# EAGLE design test_o2 (EAGLE 6.1)

## Sheet 1 of 2
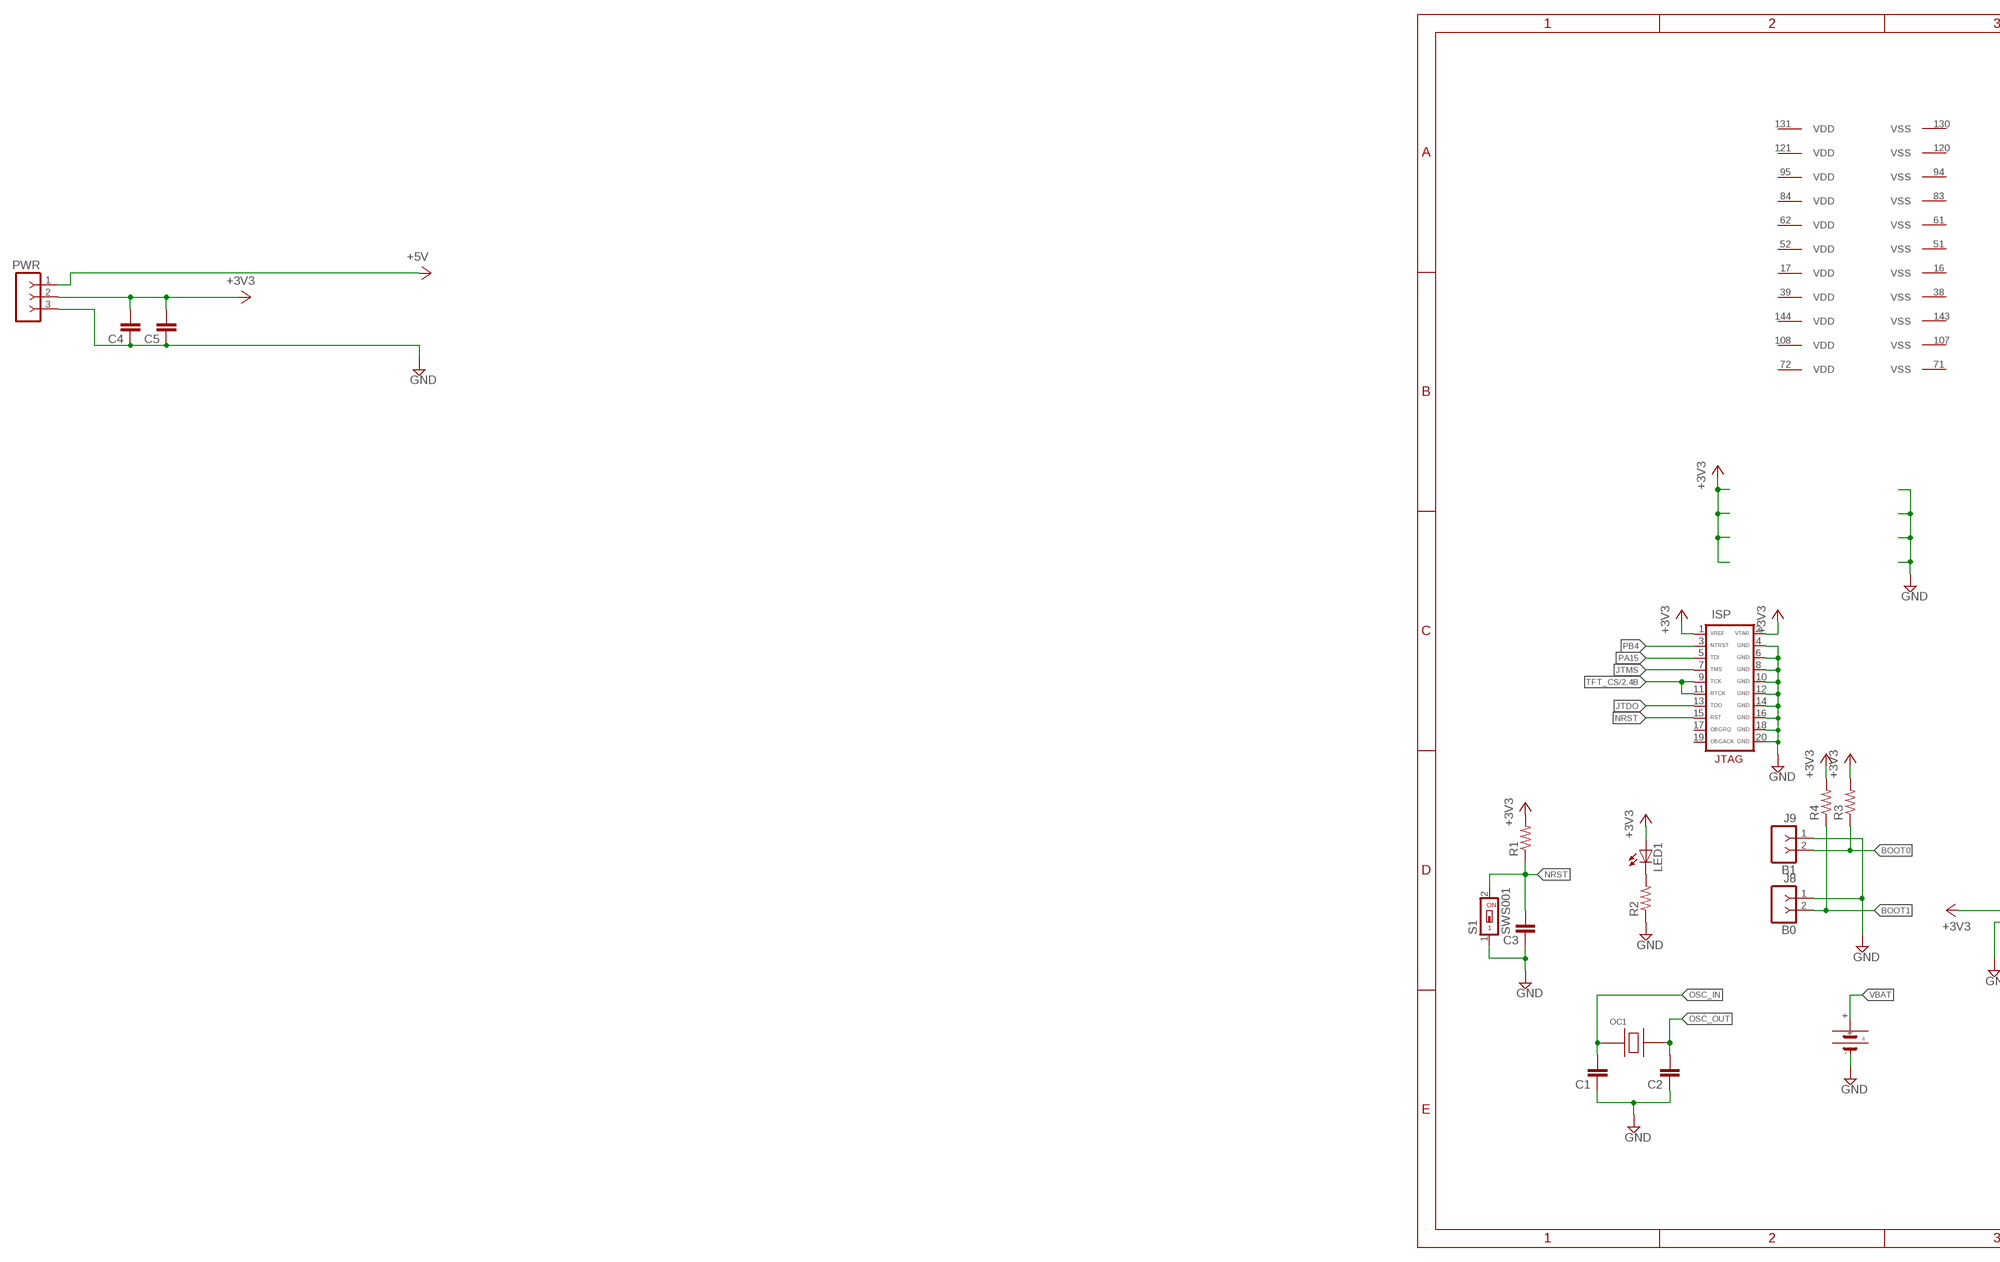
[diagram p0: schematic, sheet 1, part 1 of 2]
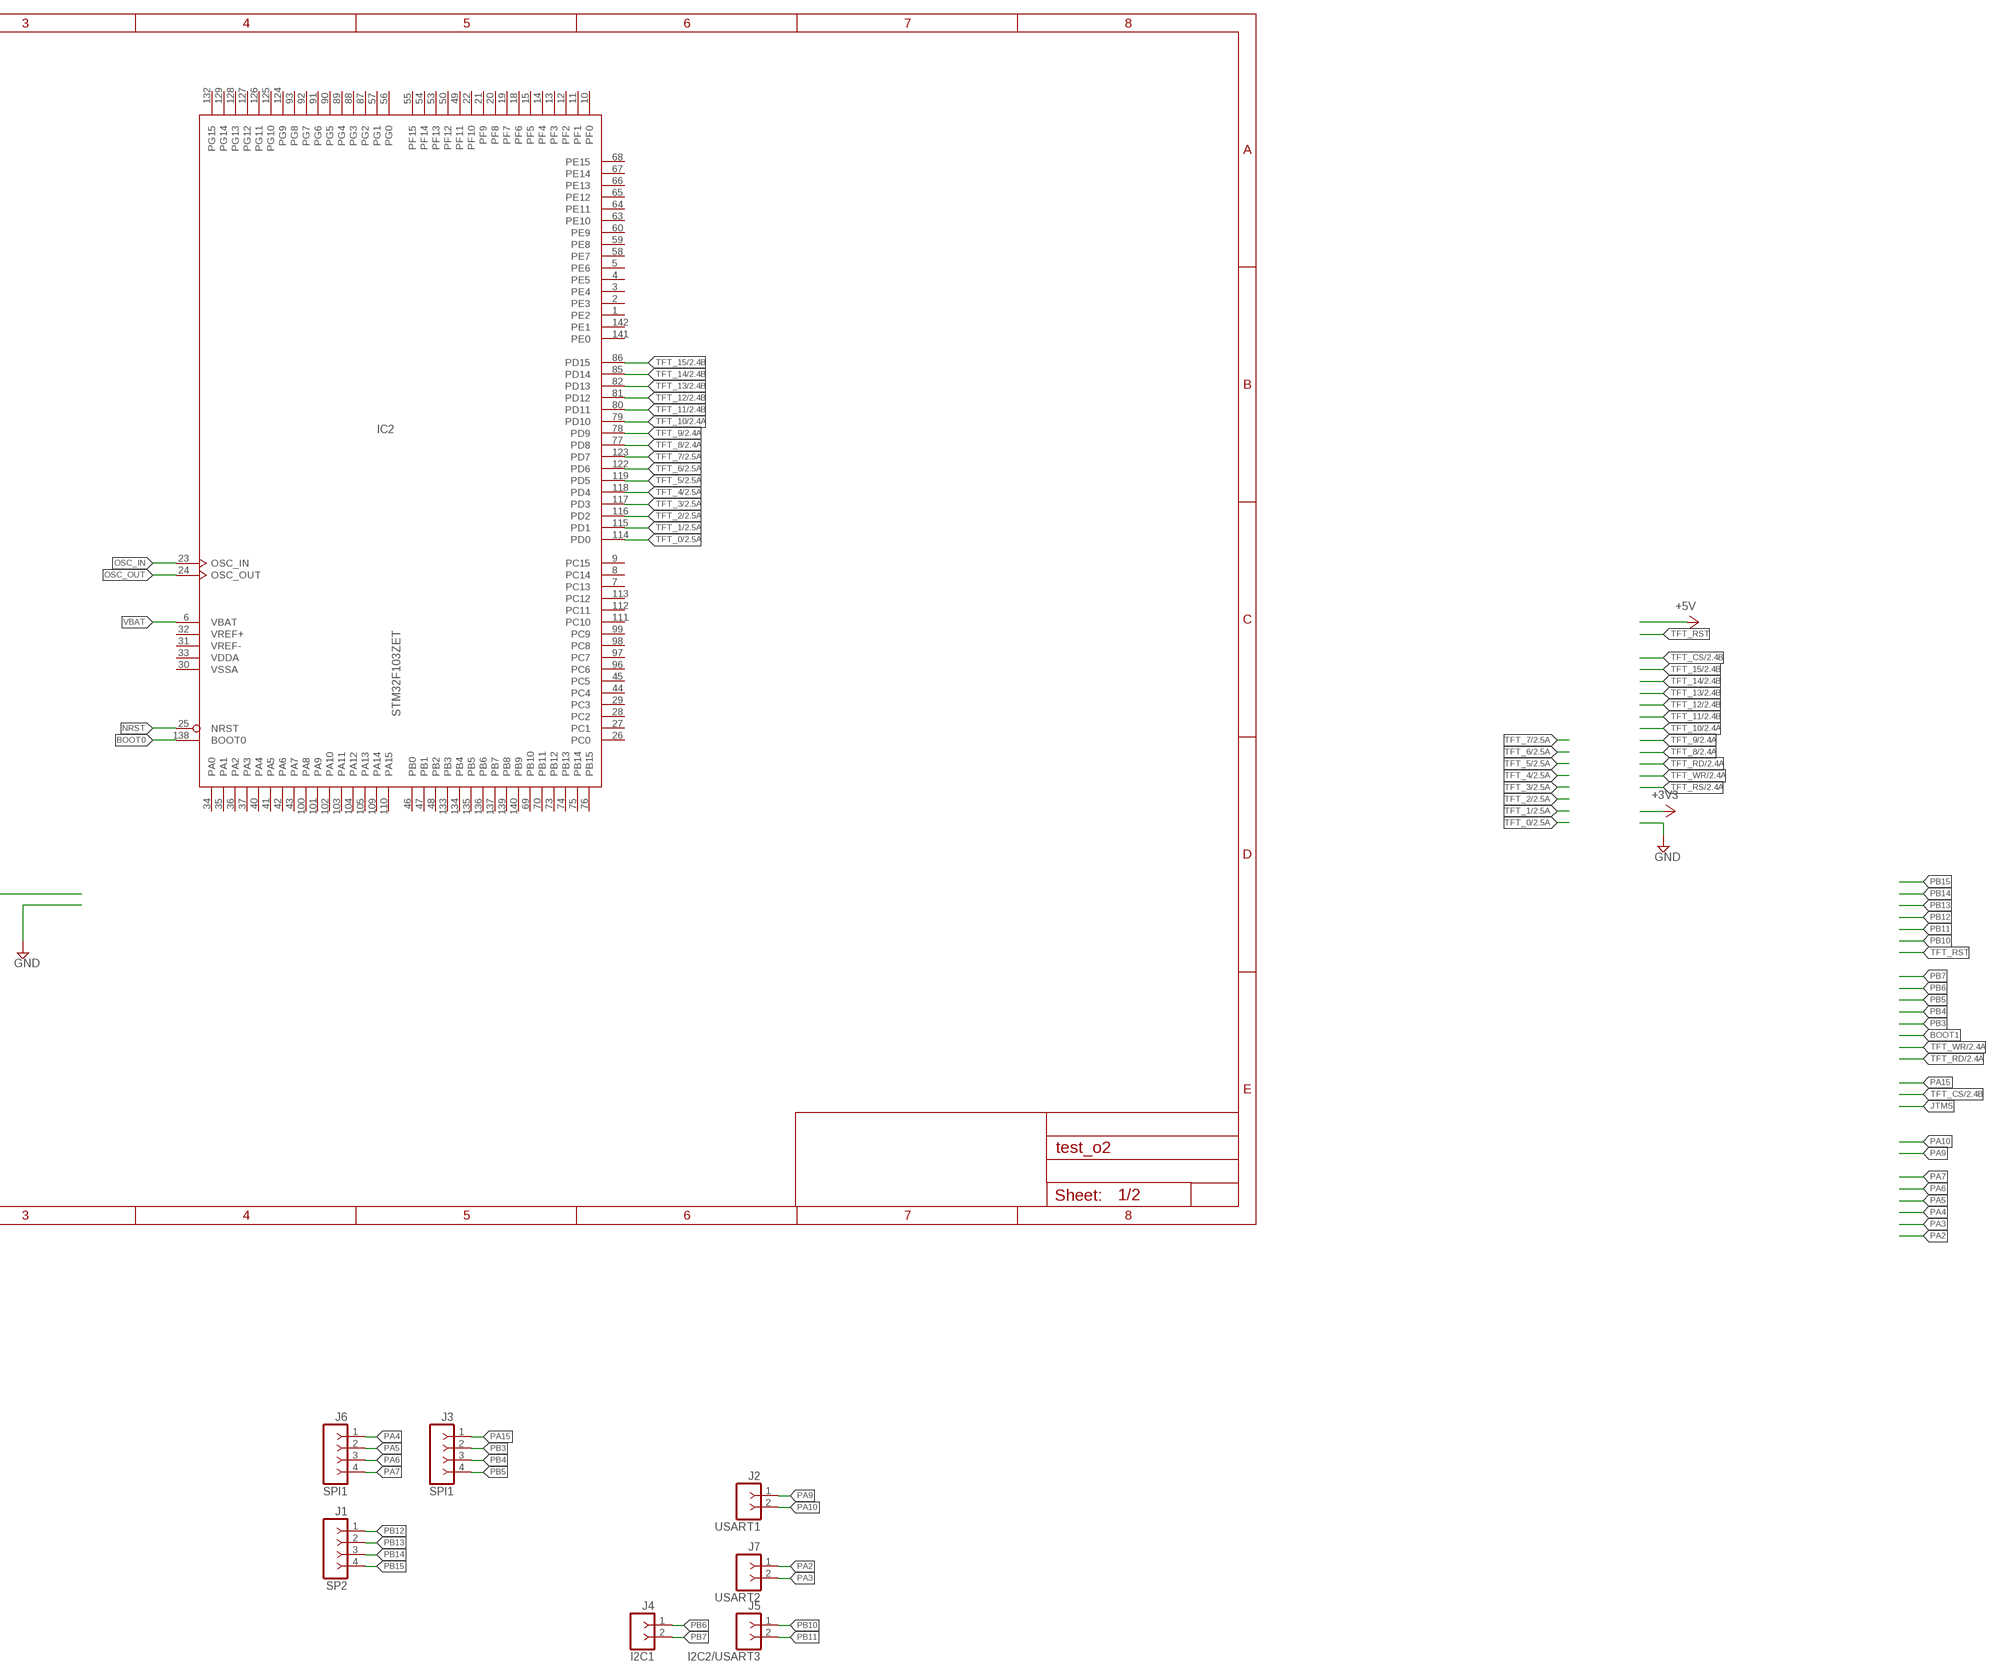
[diagram p1: schematic, sheet 1, part 2 of 2]

### Parts
C1  C-EUC1206  [C1206]
C2  C-EUC1206  [C1206]
C3  C-EUC1206  [C1206]
C4  C-EUC1206  [C1206]
C5  C-EUC1206  [C1206]
IC2  STM32F103ZET  [LQFP144]
ISP  JTAG  JTAG-ARM-PAK100/2500-20  [PAK100/2500-20]
J1  SP2  F-1X04-SIP-100-40  [SIP-100-04-40]
J2  USART1  F-1X02-SIP-100-40  [SIP-100-02-40]
J3  SPI1  F-1X04-SIP-100-40  [SIP-100-04-40]
J4  I2C1  F-1X02-SIP-100-40  [SIP-100-02-40]
J5  I2C2/USART3  F-1X02-SIP-100-40  [SIP-100-02-40]
J6  SPI1  F-1X04-SIP-100-40  [SIP-100-04-40]
J7  USART2  F-1X02-SIP-100-40  [SIP-100-02-40]
J8  B0  F-1X02-SIP-100-40  [SIP-100-02-40]
J9  B1  F-1X02-SIP-100-40  [SIP-100-02-40]
LED1  LEDSML1206  [SML1206]
OC1  SMAQ-7050B  [IQG7050B]
PWR  F-1X03-SIP-100-40  [SIP-100-03-40]
R1  R-US_R1206  [R1206]
R2  R-US_R1206  [R1206]
R3  R-US_R1206  [R1206]
R4  R-US_R1206  [R1206]
S1  SWS001  [SMS-001]
U$2  1220BATTERY_SF  [1220BATTERY]

### Nets
+3V3: C4.2 C5.2 ISP.1(VREF) ISP.2(VTAR) LED1.A PWR.2 R1.2 R3.2 R4.2 ; also sheet 2
+5V: PWR.1 ; also sheet 2
BOOT0: IC2.138(BOOT0) J9.2 R3.1
BOOT1: J8.2 R4.1
GND: C1.1 C2.1 C3.1 C4.1 C5.1 ISP.4(GND) ISP.6(GND) ISP.8(GND) ISP.10(GND) ISP.12(GND) ISP.14(GND) ISP.16(GND) ISP.18(GND) ISP.20(GND) J8.1 J9.1 PWR.3 R2.1 S1.1 U$2.- ; also sheet 2
JTDO: ISP.13(TDO)
JTMS: ISP.7(TMS)
N$1: LED1.C R2.2
NRST: C3.2 IC2.25(NRST) ISP.15(RST) R1.1 S1.2
OSC_IN: C1.2 IC2.23(OSC_IN) OC1.P$1(PIN1)
OSC_OUT: C2.2 IC2.24(OSC_OUT) OC1.P$3(PIN2)
PA2: J7.1
PA3: J7.2
PA4: J6.1
PA5: J6.2
PA6: J6.3
PA7: J6.4
PA9: J2.1
PA10: J2.2
PA15: ISP.5(TDI) J3.1
PB3: J3.2
PB4: ISP.3(NTRST) J3.3
PB5: J3.4
PB6: J4.1
PB7: J4.2
PB10: J5.1
PB11: J5.2
PB12: J1.1
PB13: J1.2
PB14: J1.3
PB15: J1.4
TFT_0: IC2.114(PD0) ; also sheet 2
TFT_1: IC2.115(PD1) ; also sheet 2
TFT_2: IC2.116(PD2) ; also sheet 2
TFT_3: IC2.117(PD3) ; also sheet 2
TFT_4: IC2.118(PD4) ; also sheet 2
TFT_5: IC2.119(PD5) ; also sheet 2
TFT_6: IC2.122(PD6) ; also sheet 2
TFT_7: IC2.123(PD7) ; also sheet 2
TFT_8: IC2.77(PD8) ; also sheet 2
TFT_9: IC2.78(PD9) ; also sheet 2
TFT_10: IC2.79(PD10) ; also sheet 2
TFT_11: IC2.80(PD11) ; also sheet 2
TFT_12: IC2.81(PD12) ; also sheet 2
TFT_13: IC2.82(PD13) ; also sheet 2
TFT_14: IC2.85(PD14) ; also sheet 2
TFT_15: IC2.86(PD15) ; also sheet 2
TFT_CS: ISP.9(TCK) ISP.11(RTCK) ; also sheet 2
VBAT: IC2.6(VBAT) U$2.+
Unconnected: IC2.1(PE2) IC2.2(PE3) IC2.3(PE4) IC2.4(PE5) IC2.5(PE6) IC2.7(PC13) IC2.8(PC14) IC2.9(PC15) IC2.10(PF0) IC2.11(PF1) IC2.12(PF2) IC2.13(PF3) IC2.14(PF4) IC2.15(PF5) IC2.18(PF6) IC2.19(PF7) IC2.20(PF8) IC2.21(PF9) IC2.22(PF10) IC2.26(PC0) IC2.27(PC1) IC2.28(PC2) IC2.29(PC3) IC2.34(PA0) IC2.35(PA1) IC2.36(PA2) IC2.37(PA3) IC2.40(PA4) IC2.41(PA5) IC2.42(PA6) IC2.43(PA7) IC2.44(PC4) IC2.45(PC5) IC2.46(PB0) IC2.47(PB1) IC2.48(PB2) IC2.49(PF11) IC2.50(PF12) IC2.53(PF13) IC2.54(PF14) IC2.55(PF15) IC2.56(PG0) IC2.57(PG1) IC2.58(PE7) IC2.59(PE8) IC2.60(PE9) IC2.63(PE10) IC2.64(PE11) IC2.65(PE12) IC2.66(PE13) IC2.67(PE14) IC2.68(PE15) IC2.69(PB10) IC2.70(PB11) IC2.73(PB12) IC2.74(PB13) IC2.75(PB14) IC2.76(PB15) IC2.87(PG2) IC2.88(PG3) IC2.89(PG4) IC2.90(PG5) IC2.91(PG6) IC2.92(PG7) IC2.93(PG8) IC2.96(PC6) IC2.97(PC7) IC2.98(PC8) IC2.99(PC9) IC2.100(PA8) IC2.101(PA9) IC2.102(PA10) IC2.103(PA11) IC2.104(PA12) IC2.105(PA13) IC2.109(PA14) IC2.110(PA15) IC2.111(PC10) IC2.112(PC11) IC2.113(PC12) IC2.124(PG9) IC2.125(PG10) IC2.126(PG11) IC2.127(PG12) IC2.128(PG13) IC2.129(PG14) IC2.132(PG15) IC2.133(PB3) IC2.134(PB4) IC2.135(PB5) IC2.136(PB6) IC2.137(PB7) IC2.139(PB8) IC2.140(PB9) IC2.141(PE0) IC2.142(PE1) ISP.17(OBGRQ) ISP.19(OBGACK)

## Sheet 2 of 2
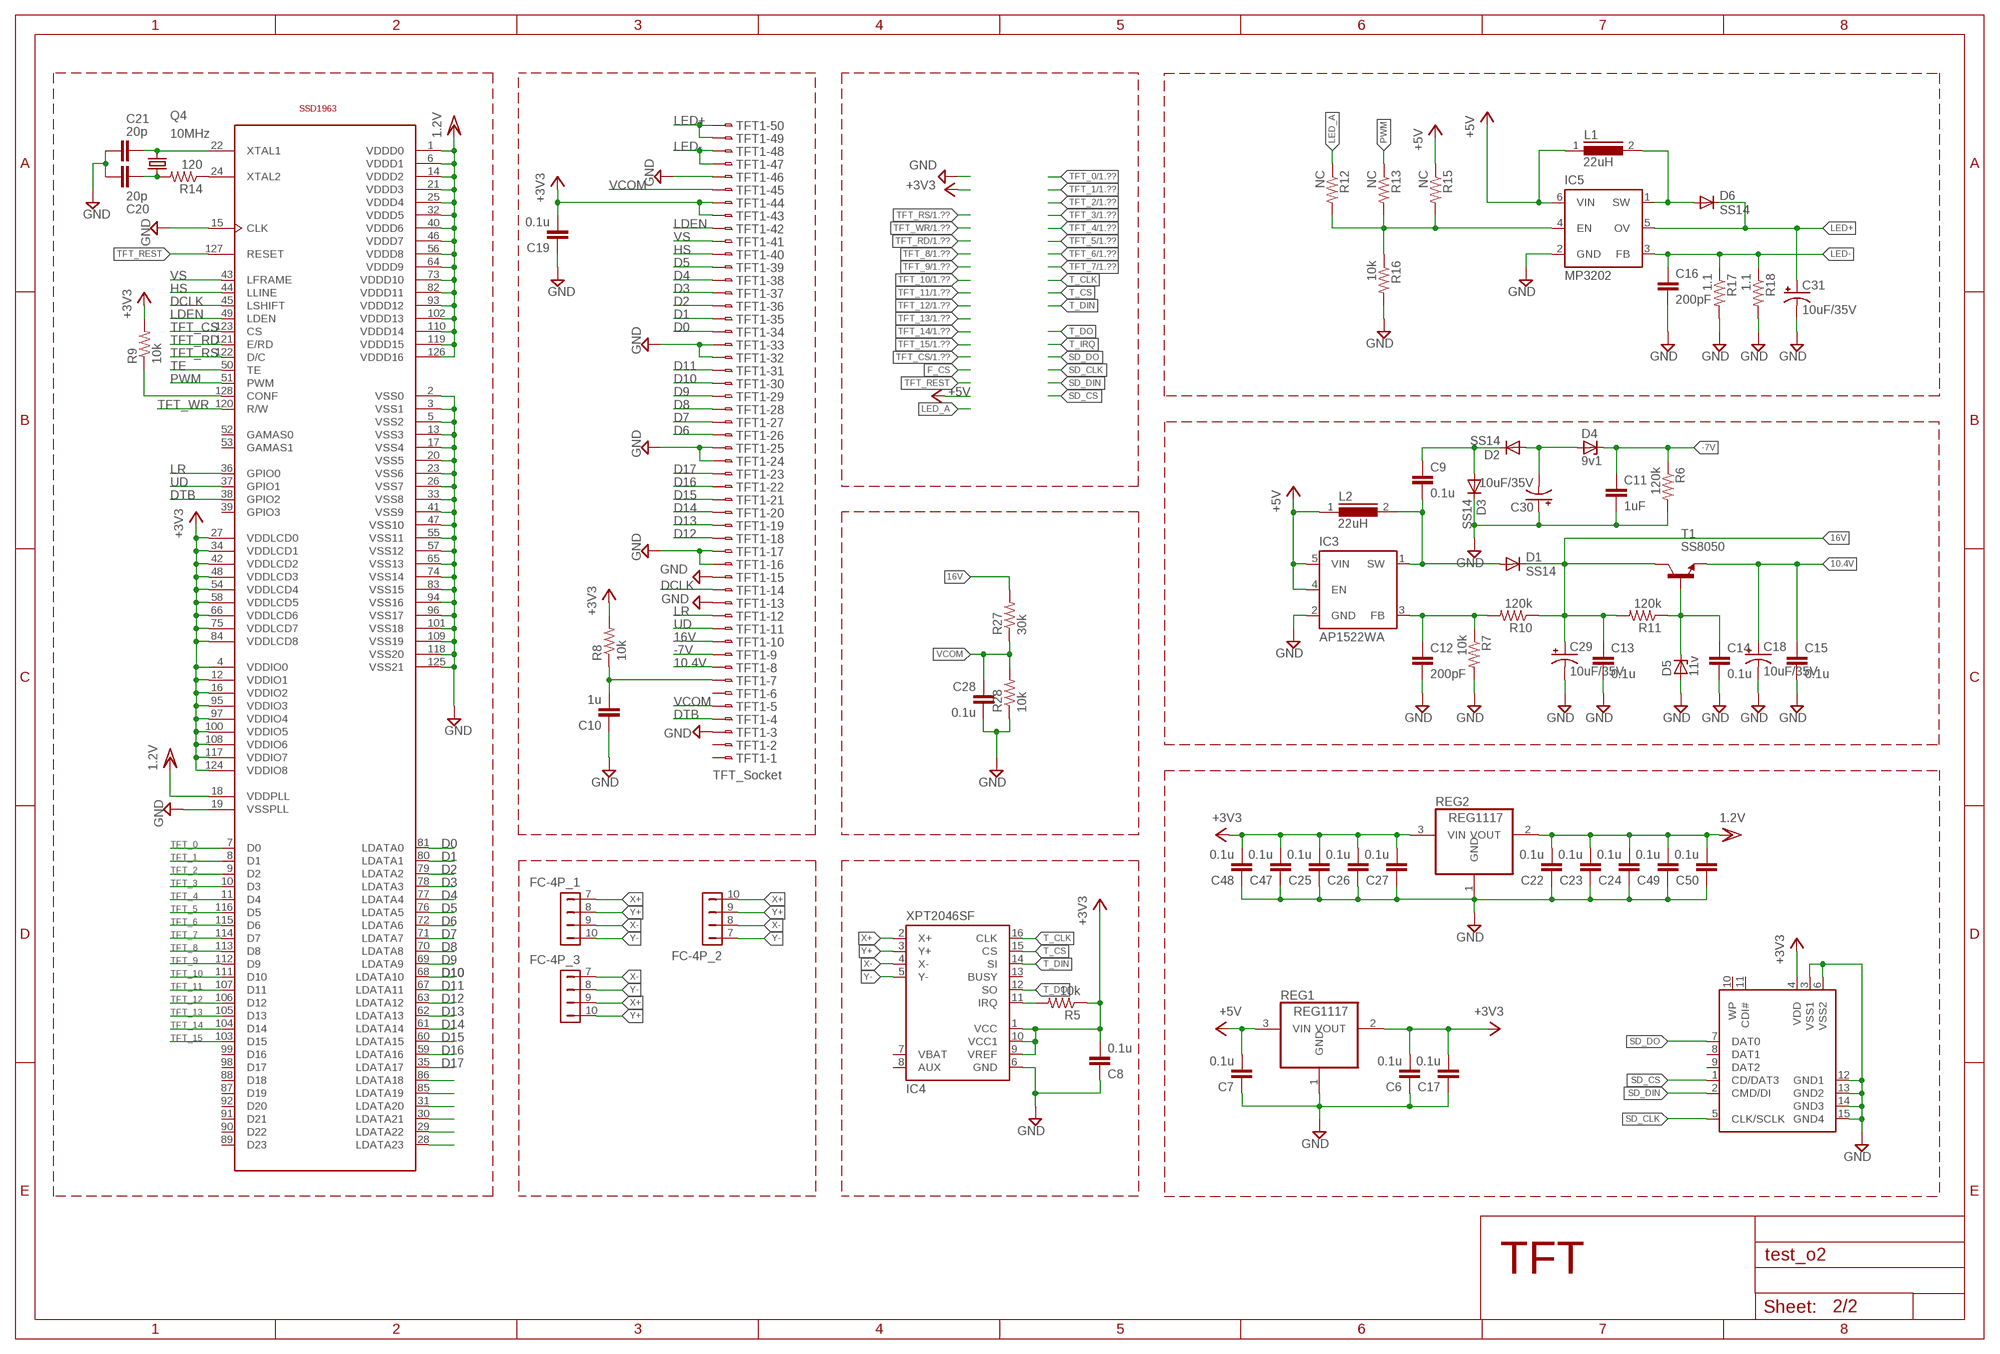
[diagram p2: schematic, sheet 2]

### Parts
C6  0.1u  C-EUC0805  [C0805]
C7  0.1u  C-EUC0805  [C0805]
C8  0.1u  C-EUC0805  [C0805]
C9  0.1u  C-EUC0805  [C0805]
C10  1u  C-EUC0805  [C0805]
C11  1uF  C-EUC0805  [C0805]
C12  200pF  C-EUC0805  [C0805]
C13  0.1u  C-EUC0805  [C0805]
C14  0.1u  C-EUC0805  [C0805]
C15  0.1u  C-EUC0805  [C0805]
C16  200pF  C-EUC0805  [C0805]
C17  0.1u  C-EUC0805  [C0805]
C18  10uF/35V  CPOL-USB/3528-21R  [B/3528-21R]
C19  0.1u  C-EUC0805  [C0805]
C20  20p  C-EUC0805  [C0805]
C21  20p  C-EUC0805  [C0805]
C22  0.1u  C-EUC0805  [C0805]
C23  0.1u  C-EUC0805  [C0805]
C24  0.1u  C-EUC0805  [C0805]
C25  0.1u  C-EUC0805  [C0805]
C26  0.1u  C-EUC0805  [C0805]
C27  0.1u  C-EUC0805  [C0805]
C28  0.1u  C-EUC0805  [C0805]
C29  10uF/35V  CPOL-USB/3528-21R  [B/3528-21R]
C30  10uF/35V  CPOL-USB/3528-21R  [B/3528-21R]
C31  10uF/35V  CPOL-USB/3528-21R  [B/3528-21R]
C47  0.1u  C-EUC0805  [C0805]
C48  0.1u  C-EUC0805  [C0805]
C49  0.1u  C-EUC0805  [C0805]
C50  0.1u  C-EUC0805  [C0805]
D1  SS14  DIODE-DO214AC  [DO214AC]
D2  SS14  DIODE-DO214AC  [DO214AC]
D3  SS14  DIODE-DO214AC  [DO214AC]
D4  9v1  ZENER-DIODESOD80C  [SOD80C]
D5  11v  ZENER-DIODESOD80C  [SOD80C]
D6  SS14  DIODE-DO214AC  [DO214AC]
FC-4P_1  FH12-04S-1S  [FH12-4S-1SH]
FC-4P_2  FH12-04S-1S  [FH12-4S-1SH]
FC-4P_3  FH12-04S-1S  [FH12-4S-1SH]
IC1  SSD1963LQFP  [LQFP128]
IC3  AP1522WA  [SOT23-5L]
IC4  XPT2046SF  [TSSOP16L]
IC5  MP3202  [SOT23-6L]
L1  22uH  DR74  [DR74]
L2  22uH  DR74  [DR74]
Q4  10MHz  CRYSTALHC49UP  [HC49UP]
R5  10k  R-US_R0805  [R0805]
R6  120k  R-US_R0805  [R0805]
R7  10k  R-US_R0805  [R0805]
R8  10k  R-US_M0805  [M0805]
R9  10k  R-US_M0805  [M0805]
R10  120k  R-US_R0805  [R0805]
R11  120k  R-US_R0805  [R0805]
R12  NC  R-US_R0805  [R0805]
R13  NC  R-US_R0805  [R0805]
R14  120  R-US_M0805  [M0805]
R15  NC  R-US_R0805  [R0805]
R16  10k  R-US_R0805  [R0805]
R17  1.1  R-US_R0805  [R0805]
R18  1.1  R-US_R0805  [R0805]
R27  30k  R-US_M0805  [M0805]
R28  10k  R-US_M0805  [M0805]
REG1  REG1117  [SOT223]
REG2  REG1117  [SOT223]
SOC_1  MMC/SD  SDCARDVAR2  [SDCMF-10915W010]
T1  SS8050  BC847  [SOT23]
TFT1  TFT_Socket  FH28-50S-0.5SH(51)XL  [50]

### Nets
10.4V: C15.1 C18.+ T1.2(E) TFT1.8
16V: C13.1 C29.+ D1.C R10.1 R11.2 R27.2 T1.3(C) TFT1.10
+3V3: C6.2 C8.2 C17.2 C19.2 C25.2 C26.2 C27.2 C47.2 C48.2 IC1.4(VDDIO0) IC1.12(VDDIO1) IC1.16(VDDIO2) IC1.27(VDDLCD0) IC1.34(VDDLCD1) IC1.42(VDDLCD2) IC1.48(VDDLCD3) IC1.54(VDDLCD4) IC1.58(VDDLCD5) IC1.66(VDDLCD6) IC1.75(VDDLCD7) IC1.84(VDDLCD8) IC1.95(VDDIO3) IC1.97(VDDIO4) IC1.100(VDDIO5) IC1.108(VDDIO6) IC1.117(VDDIO7) IC1.124(VDDIO8) IC4.1(VCC) IC4.9(VREF) IC4.10(VCC1) R5.1 R8.2 R9.2 REG1.2(VOUT) REG2.3(VIN) SOC_1.4(VDD) TFT1.43 TFT1.44 ; also sheet 1
+5V: C7.2 IC3.4(EN) IC3.5(VIN) IC5.6(VIN) L1.1 L2.1 R15.1 REG1.3(VIN) ; also sheet 1
-7V: C11.1 D4.C R6.1 TFT1.9
D0: IC1.81(LDATA0) TFT1.34
D1: IC1.80(LDATA1) TFT1.35
D2: IC1.79(LDATA2) TFT1.36
D3: IC1.78(LDATA3) TFT1.37
D4: IC1.77(LDATA4) TFT1.38
D5: IC1.76(LDATA5) TFT1.39
D6: IC1.72(LDATA6) TFT1.26
D7: IC1.71(LDATA7) TFT1.27
D8: IC1.70(LDATA8) TFT1.28
D9: IC1.69(LDATA9) TFT1.29
D10: IC1.68(LDATA10) TFT1.30
D11: IC1.67(LDATA11) TFT1.31
D12: IC1.63(LDATA12) TFT1.18
D13: IC1.62(LDATA13) TFT1.19
D14: IC1.61(LDATA14) TFT1.20
D15: IC1.60(LDATA15) TFT1.21
D16: IC1.59(LDATA16) TFT1.22
D17: IC1.35(LDATA17) TFT1.23
DCLK: IC1.45(LSHIFT) TFT1.14
DTB: IC1.38(GPIO2) TFT1.4
GND: C6.1 C7.1 C8.1 C10.1 C11.2 C12.2 C13.2 C14.2 C15.2 C16.2 C17.1 C18.- C19.1 C20.1 C21.1 C22.1 C23.1 C24.1 C25.1 C26.1 C27.1 C28.2 C29.- C30.+ C31.- C47.1 C48.1 C49.1 C50.1 D3.C D5.A IC1.2(VSS0) IC1.3(VSS1) IC1.5(VSS2) IC1.13(VSS3) IC1.15(CLK) IC1.17(VSS4) IC1.19(VSSPLL) IC1.20(VSS5) IC1.23(VSS6) IC1.26(VSS7) IC1.33(VSS8) IC1.41(VSS9) IC1.47(VSS10) IC1.55(VSS11) IC1.57(VSS12) IC1.65(VSS13) IC1.74(VSS14) IC1.83(VSS15) IC1.94(VSS16) IC1.96(VSS17) IC1.101(VSS18) IC1.109(VSS19) IC1.118(VSS20) IC1.125(VSS21) IC3.2(GND) IC4.6(GND) IC5.2(GND) R6.2 R7.2 R16.2 R17.2 R18.2 R28.1 REG1.1(GND) REG2.1(GND) SOC_1.3(VSS1) SOC_1.6(VSS2) SOC_1.12(GND1) SOC_1.13(GND2) SOC_1.14(GND3) SOC_1.15(GND4) TFT1.3 TFT1.13 TFT1.15 TFT1.16 TFT1.17 TFT1.24 TFT1.25 TFT1.32 TFT1.33 TFT1.46 ; also sheet 1
HS: IC1.44(LLINE) TFT1.40
LDEN: IC1.49(LDEN) TFT1.42
LED+: C31.+ D6.C IC5.5(OV) TFT1.49 TFT1.50
LED-: C16.1 IC5.3(FB) R17.1 R18.1 TFT1.47 TFT1.48
LED_A: R12.1
LR: IC1.36(GPIO0) TFT1.12
N$5: IC1.24(XTAL2) R14.1
N$6: C9.2 D1.A IC3.1(SW) L2.2
N$7: C9.1 D2.C D3.A
N$8: C30.- D2.A D4.A
N$9: C12.1 IC3.3(FB) R7.1 R10.2
N$11: D6.A IC5.1(SW) L1.2
N$12: C14.1 D5.C R11.1 T1.1(B)
N$13: IC5.4(EN) R12.2 R13.2 R15.2 R16.1
N$15: C21.2 IC1.22(XTAL1) Q4.2
N$16: C20.2 Q4.1 R14.2
N$17: IC1.86(LDATA18)
N$19: IC1.85(LDATA19)
N$20: IC1.31(LDATA20)
N$21: IC1.30(LDATA21)
N$22: IC1.29(LDATA22)
N$23: IC1.28(LDATA23)
N$24: IC1.128(CONF) R9.1
N$28: C10.2 R8.1 TFT1.7
PWM: IC1.51(PWM) R13.1
SD_CLK: SOC_1.5(CLK/SCLK)
SD_CS: SOC_1.1(CD/DAT3)
SD_DIN: SOC_1.2(CMD/DI)
SD_DO: SOC_1.7(DAT0)
T_CLK: IC4.16(CLK)
T_CS: IC4.15(CS)
T_DIN: IC4.14(SI)
T_DO: IC4.12(SO)
T_IRQ: IC4.11(IRQ) R5.2
TE: IC1.50(TE)
TFT_0: IC1.7(D0) ; also sheet 1
TFT_1: IC1.8(D1) ; also sheet 1
TFT_2: IC1.9(D2) ; also sheet 1
TFT_3: IC1.10(D3) ; also sheet 1
TFT_4: IC1.11(D4) ; also sheet 1
TFT_5: IC1.116(D5) ; also sheet 1
TFT_6: IC1.115(D6) ; also sheet 1
TFT_7: IC1.114(D7) ; also sheet 1
TFT_8: IC1.113(D8) ; also sheet 1
TFT_9: IC1.112(D9) ; also sheet 1
TFT_10: IC1.111(D10) ; also sheet 1
TFT_11: IC1.107(D11) ; also sheet 1
TFT_12: IC1.106(D12) ; also sheet 1
TFT_13: IC1.105(D13) ; also sheet 1
TFT_14: IC1.104(D14) ; also sheet 1
TFT_15: IC1.103(D15) ; also sheet 1
TFT_CS: IC1.123(CS) ; also sheet 1
TFT_RD: IC1.121(E/RD) ; also sheet 1
TFT_REST: IC1.127(RESET)
TFT_RS: IC1.122(D/C) ; also sheet 1
TFT_WR: IC1.120(R/W) ; also sheet 1
UD: IC1.37(GPIO1) TFT1.11
VCC/2: C22.2 C23.2 C24.2 C49.2 C50.2 IC1.1(VDDD0) IC1.6(VDDD1) IC1.14(VDDD2) IC1.18(VDDPLL) IC1.21(VDDD3) IC1.25(VDDD4) IC1.32(VDDD5) IC1.40(VDDD6) IC1.46(VDDD7) IC1.56(VDDD8) IC1.64(VDDD9) IC1.73(VDDD10) IC1.82(VDDD11) IC1.93(VDDD12) IC1.102(VDDD13) IC1.110(VDDD14) IC1.119(VDDD15) IC1.126(VDDD16) REG2.2(VOUT) ; supply symbol labelled 1.2V
VCOM: C28.1 R27.1 R28.2 TFT1.5 TFT1.45
VS: IC1.43(LFRAME) TFT1.41
X+: FC-4P_1.7 FC-4P_2.10 FC-4P_3.9 IC4.2(X+)
X-: FC-4P_1.9 FC-4P_2.8 FC-4P_3.7 IC4.4(X-)
Y+: FC-4P_1.8 FC-4P_2.9 FC-4P_3.10 IC4.3(Y+)
Y-: FC-4P_1.10 FC-4P_2.7 FC-4P_3.8 IC4.5(Y-)
Unconnected: IC1.39(GPIO3) IC1.52(GAMAS0) IC1.53(GAMAS1) IC1.87(D19) IC1.88(D18) IC1.89(D23) IC1.90(D22) IC1.91(D21) IC1.92(D20) IC1.98(D17) IC1.99(D16) IC4.7(VBAT) IC4.8(AUX) IC4.13(BUSY) SOC_1.8(DAT1) SOC_1.9(DAT2) SOC_1.10(WP) SOC_1.11(CDI#) TFT1.1 TFT1.2 TFT1.6

### Notes on the sheet
- TFT

## Power pins joined to a net without a drawn wire
VDD: IC2.17(VDD) IC2.39(VDD) IC2.52(VDD) IC2.62(VDD) IC2.72(VDD) IC2.84(VDD) IC2.95(VDD) IC2.108(VDD) IC2.121(VDD) IC2.131(VDD) IC2.144(VDD)
VDDA: IC2.33(VDDA)
VREF+: IC2.32(VREF+)
VREF-: IC2.31(VREF-)
VSS: IC2.16(VSS) IC2.38(VSS) IC2.51(VSS) IC2.61(VSS) IC2.71(VSS) IC2.83(VSS) IC2.94(VSS) IC2.107(VSS) IC2.120(VSS) IC2.130(VSS) IC2.143(VSS)
VSSA: IC2.30(VSSA)

## Library data of the parts
C1-C5 = resistor:C-EU: CAPACITOR, European symbol
C6-C17 C19-C28 C47-C50 = rcl:C-EU: CAPACITOR, European symbol
C18 C29-C31 = rcl:CPOL-US: POLARIZED CAPACITOR, American symbol
D1-D3 D6 = diode:DIODE-: DIODE
D4 D5 = diode:ZENER-DIODE: Z-Diode
FC-4P_1-FC-4P_3 = con-hirose:FH12-04S-1S
IC1 = 2ref-packages-longpad:SSD1963
IC2 = micro-stm:STM32F103Z*T: ARM 32-bit Cortex™-M3 CPU 72 MHz maximum frequency 256 to 1024 Kbytes of Flash memory 48 to 96 kbytes of SRAM 112 GPIOs 2.0 to 3.6 V application supply
IC3 = 2ref-packages-longpad:AP1522WA
IC4 = 2ref-packages-longpad:XPT2046
IC5 = 2ref-packages-longpad:MP3202
ISP = atmel-arm:JTAG-ARM-: JTAG Programming/Debug Connector
J1 J3 J6 = con-headers-jp:F-1X04-: FEMALE HEADER
J2 J4 J5 J7-J9 = con-headers-jp:F-1X02-: FEMALE HEADER
L1 L2 = inductors:DR74: High Power Density, High Efficiency, Shielded Inductors Source: coiltronics_dr_series.pdf
LED1 = led:LED: LED OSRAM: - CHIPLED LG R971, LG N971, LY N971, LG Q971, LY Q971, LO R971, LY R971 LH N974, LH R974 LS Q976, LO Q976, LY Q976 LO Q996 - Hyper CHIPLED LW Q18S LB Q993, LB Q99A, LB R99A - SideLED LS A670, LO A670, LY A670, LG A670, LP A670 LB A673, LV A673, LT A673, LW A673 LH A674 LY A675 LS A676, LA A676, LO A676, LY A676, LW A676 LS A679, LY A679, LG A679 - Hyper Micro SIDELED® LS Y876, LA Y876, LO Y876, LY Y876 LT Y87S - SmartLED LW L88C, LW L88S LB L89C, LB L89S, LG L890 LS L89K, LO L89K, LY L89K LS L896, LA L896, LO L896, LY L896 - TOPLED LS T670, LO T670, LY T670, LG T670, LP T670 LSG T670, LSP T670, LSY T670, LOP T670, LYG T670 LG T671, LOG T671, LSG T671 LB T673, LV T673, LT T673, LW T673 LH T674 LS T676, LA T676, LO T676, LY T676, LB T676, LH T676, LSB T676, LW T676 LB T67C, LV T67C, LT T67C, LS T67K, LO T67K, LY T67K, LW E67C LS E67B, LA E67B, LO E67B, LY E67B, LB E67C, LV E67C, LT E67C LW T67C LS T679, LY T679, LG T679 LS T770, LO T770, LY T770, LG T770, LP T770 LB T773, LV T773, LT T773, LW T773 LH T774 LS E675, LA E675, LY E675, LS T675 LS T776, LA T776, LO T776, LY T776, LB T776 LHGB T686 LT T68C, LB T68C - Hyper Mini TOPLED® LB M676 - Mini TOPLED Santana® LG M470 LS M47K, LO M47K, LY M47K Source: http://www.osram.convergy.de LUXEON: - LUMILED® LXK2-PW12-R00, LXK2-PW12-S00, LXK2-PW14-U00, LXK2-PW14-V00 LXK2-PM12-R00, LXK2-PM12-S00, LXK2-PM14-U00 LXK2-PE12-Q00, LXK2-PE12-R00, LXK2-PE12-S00, LXK2-PE14-T00, LXK2-PE14-U00 LXK2-PB12-K00, LXK2-PB12-L00, LXK2-PB12-M00, LXK2-PB14-N00, LXK2-PB14-P00, LXK2-PB14-Q00 LXK2-PR12-L00, LXK2-PR12-M00, LXK2-PR14-Q00, LXK2-PR14-R00 LXK2-PD12-Q00, LXK2-PD12-R00, LXK2-PD12-S00 LXK2-PH12-R00, LXK2-PH12-S00 LXK2-PL12-P00, LXK2-PL12-Q00, LXK2-PL12-R00 Source: www.luxeon.com KINGBRIGHT: KA-3528ASYC Source: www.kingbright.com
OC1 = osc:SMAQ-7050B: All Quartz SMD Package SMAQ-7050B 4 Pads Pb-Free, RoHs Compliant Company Website:http://www.interquip.com/
PWR = con-headers-jp:F-1X03-: FEMALE HEADER
Q4 = crystal:CRYSTAL: CRYSTAL; OC_FARNELL: unknown; OC_NEWARK: unknown
R1-R7 R10-R13 R15-R18 = rcl:R-US_: RESISTOR, American symbol
R8 R9 R14 R27 R28 = resistor:R-US_: RESISTOR, American symbol
REG1 REG2 = burr-brown:REG1117: 800mA and 1A Low Dropout (LDO) Positive Regulator 1.8V, 2.5V, 2.85V, 3.3V, 5V, and Adj; MPN: REG1117; OC_FARNELL: 1097566; OC_NEWARK: 14P6981
S1 = smd-special:SWS001: SMD Dip Switch 1 pol.
SOC_1 = kingfont_sdcmf10915w010_covek:SDCARD: SD card connector KINGFONT SDCMF-10915W010
T1 = transistor:BC847: NPN TRANSISTOR
TFT1 = con-hirose:FH28-50S-0.5SH(51): Flexible Printed Circuit & Flexible Flat Cable ZIF Connectors 0.5 mm Pitch, 2.55 mm above the board Source: http://www.hirose.co.jp/cataloge_hp/e58618038.pdf
U$2 = battery2:1220BATTERY_SF

## Board
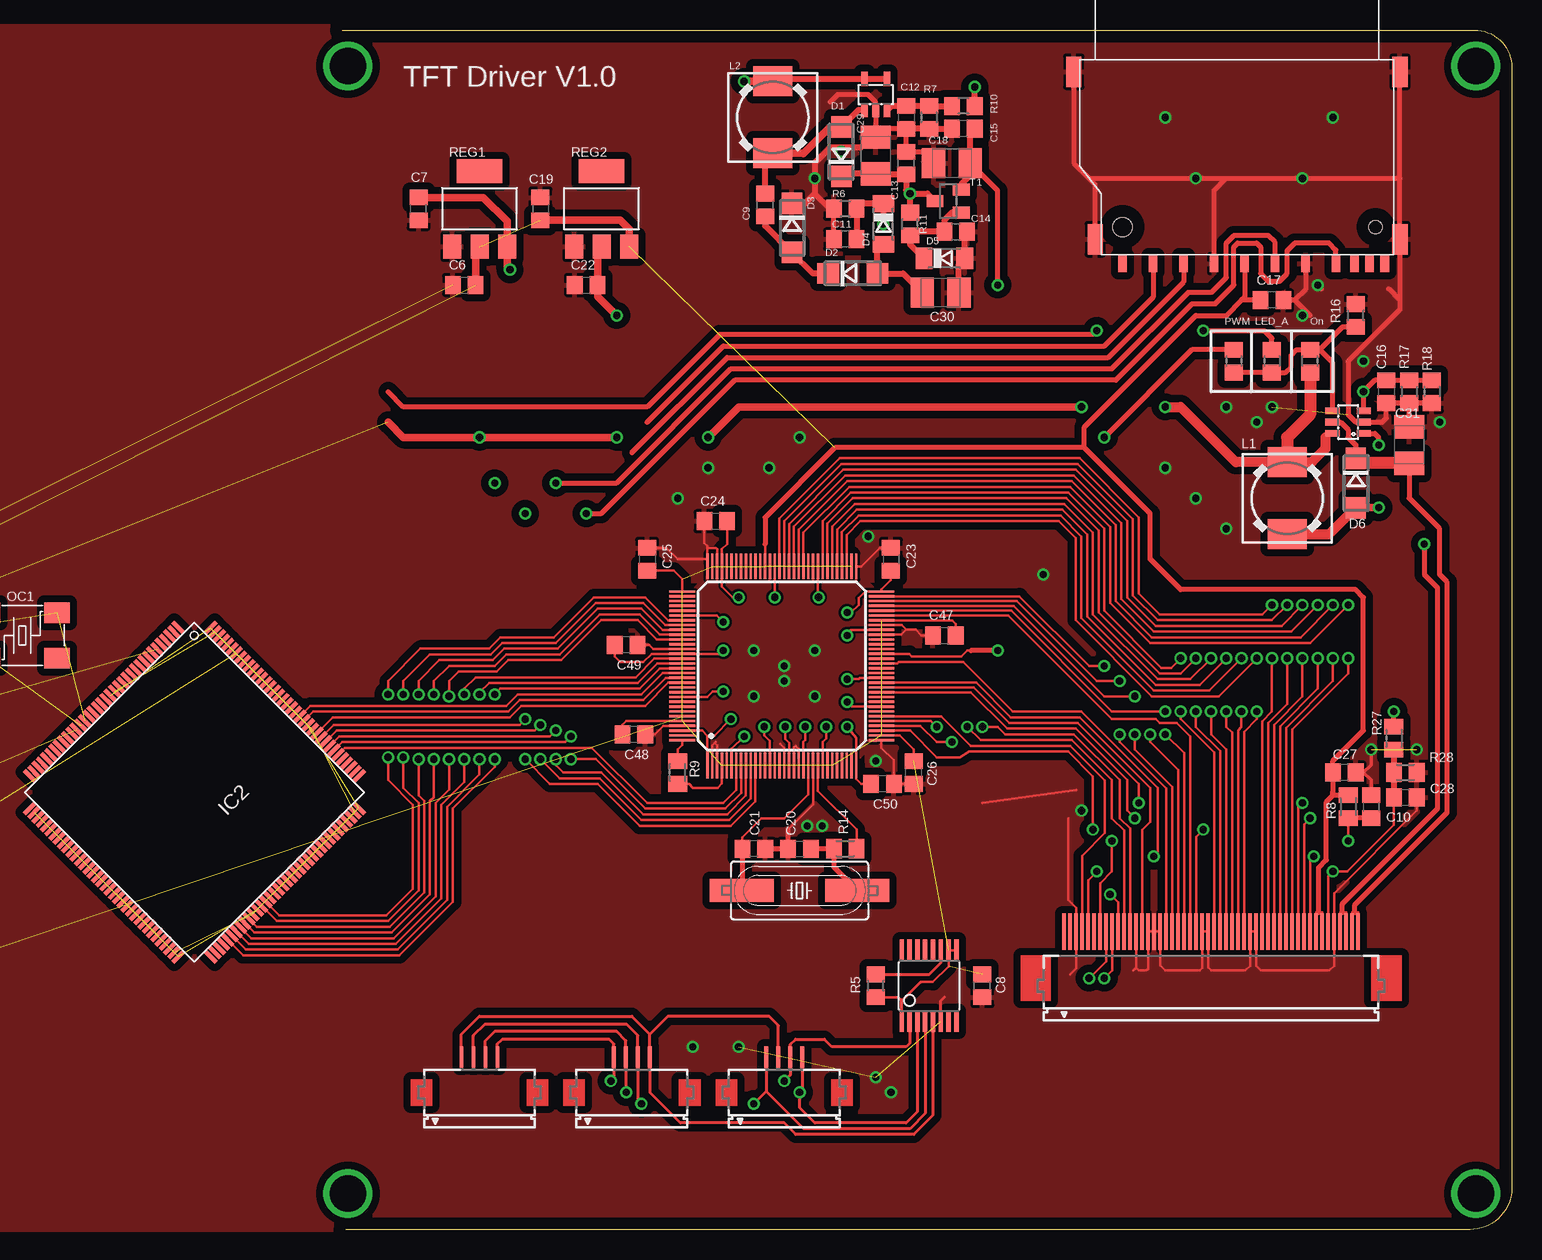
[diagram p3: board, top side]
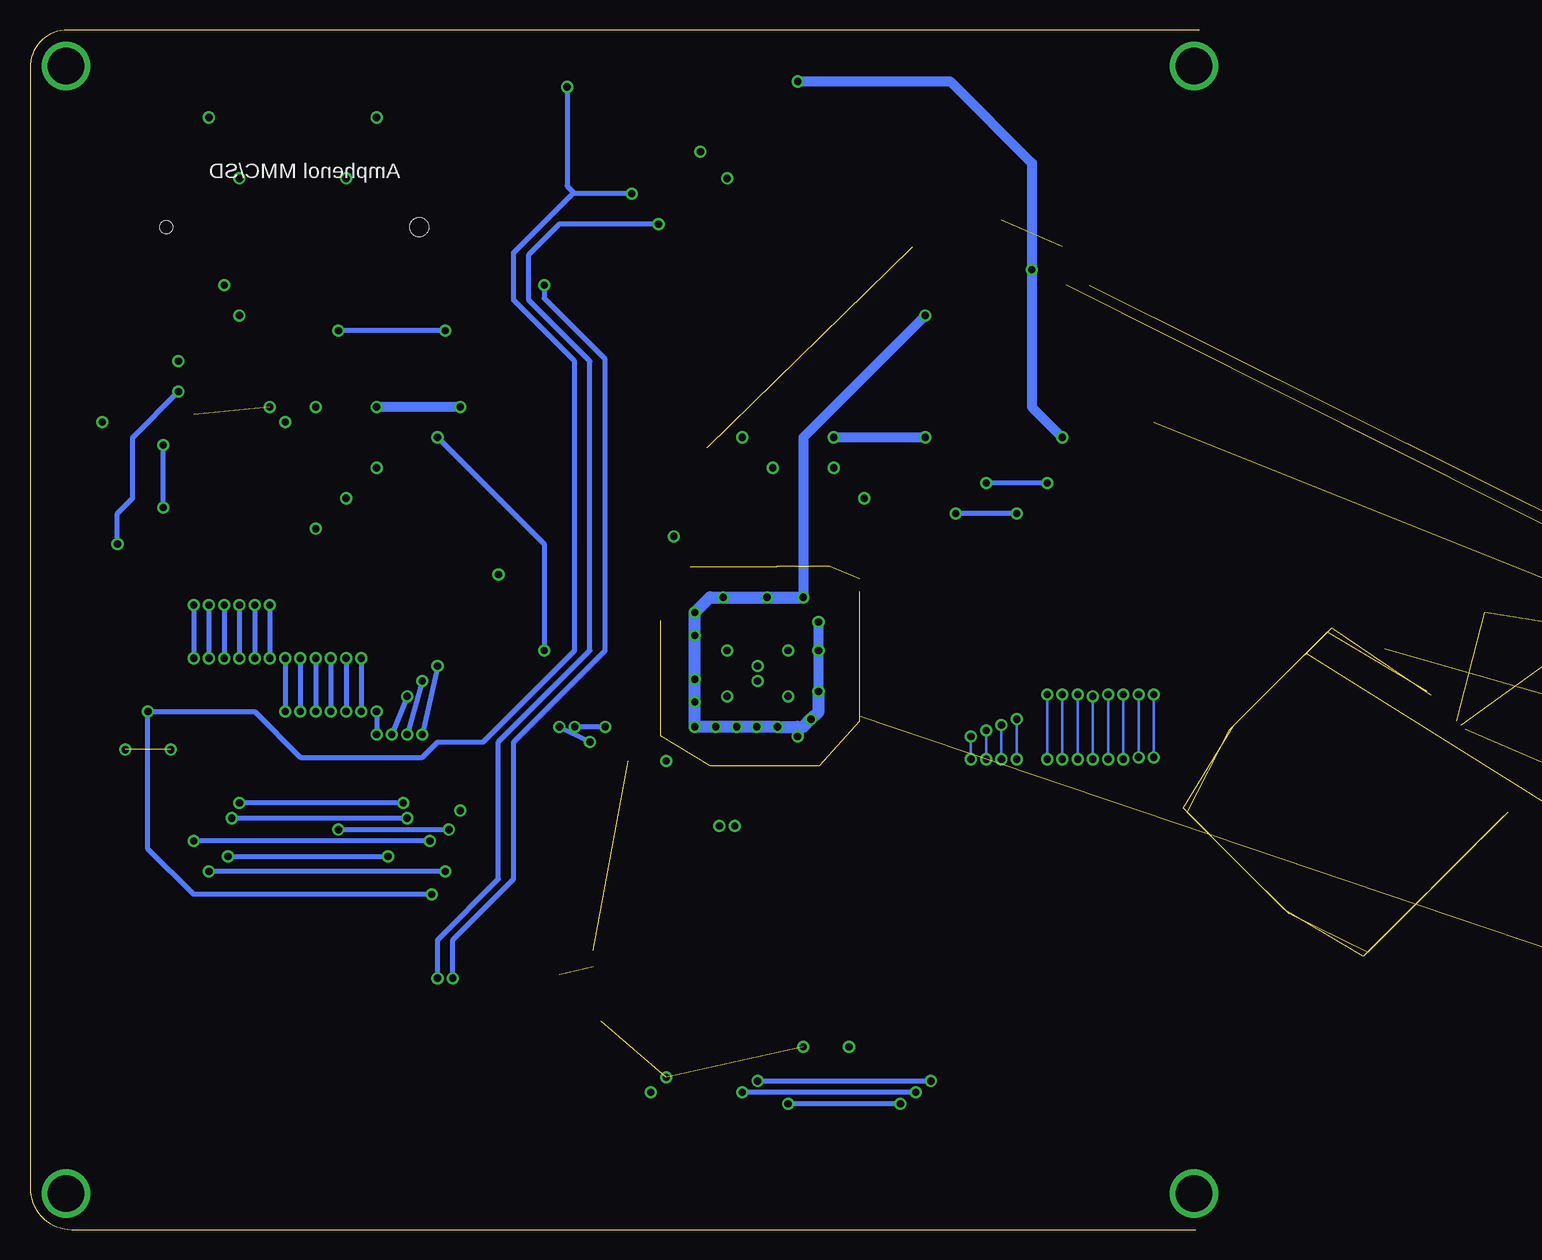
[diagram p4: board, bottom side, seen from below]

Size 97.45 x 100 mm. Coordinates in mm from the lower left corner, seen from the top.
Outline: 0.29,0 93.97,0 arc90 97.45,3.48 97.45,96.88 arc90 94.33,100 0,100
Copper layers (1*16): Top 0.035mm / dielectric 1.5mm / Bottom 0.035mm
Design rules: minimum track width 6mil, minimum drill 0.6mm, track to track 7mil, track to pad 7mil, pad to pad 7mil, via to via 7mil, smd to smd 7mil, copper to edge 40mil, drill to drill 8mil, minimum pad ring 10mil, minimum via ring 8mil, stop-mask expansion 4mil, vias tented up to drill 0.6mm, thermal gap 10mil
tRestrict: area -66,-90.2 to -63.5,-86.4; area -26.7,-57.1 to -21.6,-54.6; area -69.9,-25.4 to -64.8,-22.9
bRestrict: area -26.7,-57.1 to -21.6,-54.6; area -69.9,-25.4 to -64.8,-22.9; area -58.4,-76.2 to -57.2,-63.5; area -74.9,-76.2 to -73.7,-63.5; area -71.1,-78.7 to -59.7,-77.5; area -68.6,-62.2 to -59.7,-61; area -72.4,-62.2 to -71.1,-61; area -38.1,-101.6 to -17.8,-99.1; area -39.4,-100.3 to -38.1,-99.1
Milling: 4 lines

### Footprints (pad centres in the part's own frame; a part is rotated, then mirrored left to right if it is on the bottom)
C1206 = smd 1.6 x 1.8: 1 -1.4,0; 2 1.4,0
C0805 = smd 1.3 x 1.5: 1 -0.95,0; 2 0.95,0
B/3528-21R = smd 1.95 x 2.5: + 1.525,0; - -1.525,0
DO214AC = smd 1.8 x 1.7: A 2.05,0; C -2.05,0
SOD80C = smd 1.4 x 1.8: A 1.7,0; C -1.7,0
FH12-4S-1SH = smd 0.318 x 1.778: 7 -1.5,2.933; 8 -0.5,2.933; 9 0.5,2.933; 10 1.5,2.933
LQFP128 = smd 2.159 x 0.19: 1 -8.3,6.4; 2 -8.3,6; 3 -8.3,5.6; 4 -8.3,5.2; 5 -8.3,4.8; 6 -8.3,4.4; 7 -8.3,4; 8 -8.3,3.6; 9 -8.3,3.2; 10 -8.3,2.8; 11 -8.3,2.4; 12 -8.3,2; 13 -8.3,1.6; 14 -8.3,1.2; 15 -8.3,0.8; 16 -8.3,0.4; 17 -8.3,0; 18 -8.3,-0.4; 19 -8.3,-0.8; 20 -8.3,-1.2; 21 -8.3,-1.6; 22 -8.3,-2; 23 -8.3,-2.4; 24 -8.3,-2.8; 25 -8.3,-3.2; 26 -8.3,-3.6; 27 -8.3,-4; 28 -8.3,-4.4; 29 -8.3,-4.8; 30 -8.3,-5.2; 31 -8.3,-5.6; 32 -8.3,-6; 65 8.3,-6; 66 8.3,-5.6; 67 8.3,-5.2; 68 8.3,-4.8; 69 8.3,-4.4; 70 8.3,-4; 71 8.3,-3.6; 72 8.3,-3.2; 73 8.3,-2.8; 74 8.3,-2.4; 75 8.3,-2; 76 8.3,-1.6; 77 8.3,-1.2; 78 8.3,-0.8; 79 8.3,-0.4; 80 8.3,0; 81 8.3,0.4; 82 8.3,0.8; 83 8.3,1.2; 84 8.3,1.6; 85 8.3,2; 86 8.3,2.4; 87 8.3,2.8; 88 8.3,3.2; 89 8.3,3.6; 90 8.3,4; 91 8.3,4.4; 92 8.3,4.8; 93 8.3,5.2; 94 8.3,5.6; 95 8.3,6; 96 8.3,6.4 | smd 0.19 x 2.159: 33 -6.2,-8.1; 34 -5.8,-8.1; 35 -5.4,-8.1; 36 -5,-8.1; 37 -4.6,-8.1; 38 -4.2,-8.1; 39 -3.8,-8.1; 40 -3.4,-8.1; 41 -3,-8.1; 42 -2.6,-8.1; 43 -2.2,-8.1; 44 -1.8,-8.1; 45 -1.4,-8.1; 46 -1,-8.1; 47 -0.6,-8.1; 48 -0.2,-8.1; 49 0.2,-8.1; 50 0.6,-8.1; 51 1,-8.1; 52 1.4,-8.1; 53 1.8,-8.1; 54 2.2,-8.1; 55 2.6,-8.1; 56 3,-8.1; 57 3.4,-8.1; 58 3.8,-8.1; 59 4.2,-8.1; 60 4.6,-8.1; 61 5,-8.1; 62 5.4,-8.1; 63 5.8,-8.1; 64 6.2,-8.1; 97 6.2,8.5; 98 5.8,8.5; 99 5.4,8.5; 100 5,8.5; 101 4.6,8.5; 102 4.2,8.5; 103 3.8,8.5; 104 3.4,8.5; 105 3,8.5; 106 2.6,8.5; 107 2.2,8.5; 108 1.8,8.5; 109 1.4,8.5; 110 1,8.5; 111 0.6,8.5; 112 0.2,8.5; 113 -0.2,8.5; 114 -0.6,8.5; 115 -1,8.5; 116 -1.4,8.5; 117 -1.8,8.5; 118 -2.2,8.5; 119 -2.6,8.5; 120 -3,8.5; 121 -3.4,8.5; 122 -3.8,8.5; 123 -4.2,8.5; 124 -4.6,8.5; 125 -5,8.5; 126 -5.4,8.5; 127 -5.8,8.5; 128 -6.2,8.5
LQFP144 = smd 0.35 x 1.35: 1 -8.75,-10.625; 2 -8.25,-10.625; 3 -7.75,-10.625; 4 -7.25,-10.625; 5 -6.75,-10.625; 6 -6.25,-10.625; 7 -5.75,-10.625; 8 -5.25,-10.625; 9 -4.75,-10.625; 10 -4.25,-10.625; 11 -3.75,-10.625; 12 -3.25,-10.625; 13 -2.75,-10.62; 14 -2.25,-10.625; 15 -1.75,-10.625; 16 -1.25,-10.625; 17 -0.75,-10.625; 18 -0.25,-10.625; 19 0.25,-10.625; 20 0.75,-10.625; 21 1.25,-10.625; 22 1.75,-10.625; 23 2.25,-10.625; 24 2.75,-10.62; 25 3.25,-10.625; 26 3.75,-10.625; 27 4.25,-10.625; 28 4.75,-10.625; 29 5.25,-10.625; 30 5.75,-10.625; 31 6.25,-10.625; 32 6.75,-10.625; 33 7.25,-10.625; 34 7.75,-10.625; 35 8.25,-10.625; 36 8.75,-10.625; 73 8.75,10.625; 74 8.25,10.625; 75 7.75,10.625; 76 7.25,10.625; 77 6.75,10.625; 78 6.25,10.625; 79 5.75,10.625; 80 5.25,10.625; 81 4.75,10.625; 82 4.25,10.625; 83 3.75,10.625; 84 3.25,10.625; 85 2.75,10.625; 86 2.25,10.625; 87 1.75,10.625; 88 1.25,10.625; 89 0.75,10.625; 90 0.25,10.625; 91 -0.25,10.625; 92 -0.75,10.625; 93 -1.25,10.625; 94 -1.75,10.625; 95 -2.25,10.625; 96 -2.75,10.625; 97 -3.25,10.625; 98 -3.75,10.625; 99 -4.25,10.625; 100 -4.75,10.625; 101 -5.25,10.625; 102 -5.75,10.625; 103 -6.25,10.625; 104 -6.75,10.625; 105 -7.25,10.625; 106 -7.75,10.625; 107 -8.25,10.625; 108 -8.75,10.625 | smd 1.35 x 0.35: 37 10.625,-8.75; 38 10.625,-8.25; 39 10.625,-7.75; 40 10.625,-7.25; 41 10.625,-6.75; 42 10.625,-6.25; 43 10.625,-5.75; 44 10.625,-5.25; 45 10.625,-4.75; 46 10.625,-4.25; 47 10.625,-3.75; 48 10.625,-3.25; 49 10.625,-2.75; 50 10.625,-2.25; 51 10.625,-1.75; 52 10.625,-1.25; 53 10.625,-0.75; 54 10.625,-0.25; 55 10.625,0.25; 56 10.625,0.75; 57 10.625,1.25; 58 10.625,1.75; 59 10.625,2.25; 60 10.625,2.75; 61 10.625,3.25; 62 10.625,3.75; 63 10.625,4.25; 64 10.625,4.75; 65 10.625,5.25; 66 10.625,5.75; 67 10.625,6.25; 68 10.625,6.75; 69 10.625,7.25; 70 10.625,7.75; 71 10.625,8.25; 72 10.625,8.75; 109 -10.625,8.75; 110 -10.625,8.25; 111 -10.625,7.75; 112 -10.625,7.25; 113 -10.625,6.75; 114 -10.625,6.25; 115 -10.625,5.75; 116 -10.625,5.25; 117 -10.625,4.75; 118 -10.625,4.25; 119 -10.625,3.75; 120 -10.625,3.25; 121 -10.625,2.75; 122 -10.625,2.25; 123 -10.625,1.75; 124 -10.625,1.25; 125 -10.625,0.75; 126 -10.625,0.25; 127 -10.625,-0.25; 128 -10.625,-0.75; 129 -10.625,-1.25; 130 -10.625,-1.75; 131 -10.625,-2.25; 132 -10.625,-2.75; 133 -10.625,-3.25; 134 -10.625,-3.75; 135 -10.625,-4.25; 136 -10.625,-4.75; 137 -10.625,-5.25; 138 -10.625,-5.75; 139 -10.625,-6.25; 140 -10.625,-6.75; 141 -10.625,-7.25; 142 -10.625,-7.75; 143 -10.625,-8.25; 144 -10.625,-8.75
SOT23-5L = smd 0.55 x 1.2: 1 -0.95,-1.3; 2 0,-1.3; 3 0.95,-1.3; 4 0.95,1.3; 5 -0.95,1.3
TSSOP16L = smd 0.368 x 1.778: 1 -2.275,-2.97; 2 -1.625,-2.97; 3 -0.975,-2.97; 4 -0.325,-2.97; 5 0.325,-2.97; 6 0.975,-2.97; 7 1.625,-2.97; 8 2.275,-2.97; 9 2.275,2.97; 10 1.625,2.97; 11 0.975,2.97; 12 0.325,2.97; 13 -0.325,2.97; 14 -0.975,2.97; 15 -1.625,2.97; 16 -2.275,2.97
SOT23-6L = smd 0.55 x 1.2: 1 -0.95,-1.3; 2 0,-1.3; 3 0.95,-1.3; 4 0.95,1.3; 5 0,1.3; 6 -0.95,1.3
PAK100/2500-20 = drill 1.016 pad 1.422 square: 1 -11.43,-1.27 | drill 1.016 pad 1.422 octagon: 2 -11.43,1.27; 3 -8.89,-1.27; 4 -8.89,1.27; 5 -6.35,-1.27; 6 -6.35,1.27; 7 -3.81,-1.27; 8 -3.81,1.27; 9 -1.27,-1.27; 10 -1.27,1.27; 11 1.27,-1.27; 12 1.27,1.27; 13 3.81,-1.27; 14 3.81,1.27; 15 6.35,-1.27; 16 6.35,1.27; 17 8.89,-1.27; 18 8.89,1.27; 19 11.43,-1.27; 20 11.43,1.27
SIP-100-04-40 = drill 1.016 pad 1.778 square: 1 -3.81,0 | drill 1.016 pad 1.778 octagon: 2 -1.27,0; 3 1.27,0; 4 3.81,0
SIP-100-02-40 = drill 1.016 pad 1.778 square: 1 -1.27,0 | drill 1.016 pad 1.778 octagon: 2 1.27,0
DR74 = smd 2.5 x 3.25: 1 -3,0; 2 3,0
SML1206 = smd 1.5 x 1.5: A 1.75,0; C -1.75,0
IQG7050B = smd 2.1 x 1.7: P$1 -2.9,-1.9; P$2 2.9,-1.9; P$3 2.9,1.9; P$4 -2.9,1.9
SIP-100-03-40 = drill 1.016 pad 1.778 square: 1 -2.54,0 | drill 1.016 pad 1.778 octagon: 2 0,0; 3 2.54,0
HC49UP = smd 5.334 x 1.93: 1 -4.826,0; 2 4.826,0
R1206 = smd 1.6 x 1.803: 1 -1.422,0; 2 1.422,0
R0805 = smd 1.3 x 1.5: 1 -0.95,0; 2 0.95,0
M0805 = smd 1.3 x 1.6: 1 -0.95,0; 2 0.95,0
SOT223 = smd 1.499 x 2.007: 1 -2.261,-3.15; 2 0.025,-3.15; 3 2.311,-3.15 | smd 3.81 x 2.007: 4 0,3.15
SMS-001 = smd 1.092 x 2.007: 1 0,-4.496; 2 0,4.496
SDCMF-10915W010 = smd 0.711 x 1.422: 1 7.366,13.462; 2 4.826,13.462; 3 2.286,13.462; 4 -0.254,13.462; 5 -2.794,13.462; 6 -5.334,13.462; 7 -7.874,13.462; 8 -9.398,13.462; 9 9.906,13.462; 10 -11.938,13.462; 11 -10.668,13.462 | smd 1.27 x 2.54: 12 12.192,11.43; 13 13.97,-2.54; 14 -13.208,-2.54; 15 -13.208,11.43 | hole 1.6: 9.906,10.414 | hole 1.1: -11.176,10.414
SOT23 = smd 1 x 1.4: 1 -0.95,-1.1; 2 0.95,-1.1; 3 0,1.1
50 = smd 0.267 x 3.048: 1 -12.25,4.52; 2 -11.75,4.52; 3 -11.25,4.52; 4 -10.75,4.52; 5 -10.25,4.52; 6 -9.75,4.52; 7 -9.25,4.52; 8 -8.75,4.52; 9 -8.25,4.52; 10 -7.75,4.52; 11 -7.25,4.52; 12 -6.75,4.52; 13 -6.25,4.52; 14 -5.75,4.52; 15 -5.25,4.52; 16 -4.75,4.52; 17 -4.25,4.52; 18 -3.75,4.52; 19 -3.25,4.52; 20 -2.75,4.52; 21 -2.25,4.52; 22 -1.75,4.52; 23 -1.25,4.52; 24 -0.75,4.52; 25 -0.25,4.52; 26 0.25,4.52; 27 0.75,4.52; 28 1.25,4.52; 29 1.75,4.52; 30 2.25,4.52; 31 2.75,4.52; 32 3.25,4.52; 33 3.75,4.52; 34 4.25,4.52; 35 4.75,4.52; 36 5.25,4.52; 37 5.75,4.52; 38 6.25,4.52; 39 6.75,4.52; 40 7.25,4.52; 41 7.75,4.52; 42 8.25,4.52; 43 8.75,4.52; 44 9.25,4.52; 45 9.75,4.52; 46 10.25,4.52; 47 10.75,4.52; 48 11.25,4.52; 49 11.75,4.52; 50 12.25,4.52
1220BATTERY = smd 6.452 x 3.251: + -6.985,0; - 8.255,0

### Placement (x,y rotation side)
C1  -85.1,41.91 0 top  (outside the outline)
C2  -91.45,41.91 180 top  (outside the outline)
C3  -90.18,13.97 180 bottom  (outside the outline)
C4  -83.19,22.86 90 bottom  (outside the outline)
C5  -74.3,37.47 315 top  (outside the outline)
C6  10.15,78.74 0 top
C7  6.34,85.09 90 top
C8  53.33,20.32 90 top
C9  35.23,85.41 90 top
C10  85.72,35.24 270 top
C11  41.9,82.55 180 top
C12  46.98,92.71 270 top
C13  46.98,88.9 90 top
C14  51.11,83.19 0 top
C15  51.74,91.76 180 top
C16  86.99,69.85 270 top
C17  77.46,77.47 180 top
C18  50.79,88.9 0 top
C19  16.5,85.09 270 top
C20  38.09,31.75 0 top
C21  34.28,31.75 180 top
C22  20.31,78.74 0 top
C23  45.71,55.88 270 top
C24  31.11,59.05 0 top
C25  25.39,55.88 270 top
C26  47.62,38.1 90 top
C27  83.49,38.1 180 top
C28  88.57,36.04 0 top
C29  44.44,89.53 270 top
C30  49.84,78.11 0 top
C31  88.89,65.41 270 top
C47  50.16,49.53 0 top
C48  24.28,41.27 180 top
C49  23.64,48.74 180 top
C50  45,37.15 180 top
D1  41.58,89.85 90 top
D2  42.54,79.69 0 top
D3  37.46,83.5 270 top
D4  45.08,83.82 270 top
D5  50.16,80.96 0 top
D6  84.45,62.23 270 top
FC-4P_1  24.12,11.43 0 top
FC-4P_2  11.42,11.43 0 top
FC-4P_3  36.82,11.43 0 top
IC1  36.82,46.99 90 top
IC2  -12.34,36.46 225 top
IC3  44.44,94.61 0 top
IC4  48.89,20.32 0 top
IC5  83.81,67.31 90 top
ISP  -80.65,5.08 180 top  (outside the outline)
J1  -59.7,12.7 90 top  (outside the outline)
J2  -59.7,20.32 90 top  (outside the outline)
J3  -59.7,27.94 90 top  (outside the outline)
J4  -64.78,36.83 90 top  (outside the outline)
J5  -101.61,12.7 270 top  (outside the outline)
J6  -101.61,20.32 270 top  (outside the outline)
J7  -101.61,27.94 270 top  (outside the outline)
J8  -66.05,13.97 180 top  (outside the outline)
J9  -66.05,11.43 180 top  (outside the outline)
L1  78.73,60.96 270 top
L2  35.87,92.71 270 top
LED1  -83.83,12.7 180 top  (outside the outline)
OC1  -26.68,49.53 180 top  (outside the outline)
PWR  -62.24,41.91 0 bottom  (outside the outline)
Q4  38.09,28.26 180 top
R1  -85.1,13.97 180 bottom  (outside the outline)
R2  -78.75,12.7 180 top  (outside the outline)
R3  -77.48,22.86 0 bottom  (outside the outline)
R4  -77.48,20.32 0 bottom  (outside the outline)
R5  44.44,20.32 90 top
R6  41.9,85.09 180 top
R7  48.89,92.71 270 top
R8  83.81,35.24 90 top
R9  27.93,38.1 270 top
R10  51.74,93.66 180 top
R11  47.3,83.82 90 top
R12  77.46,72.39 270 top
R13  74.29,72.39 270 top
R14  41.9,31.75 180 top
R15  80.64,72.39 90 top
R16  84.45,76.2 90 top
R17  88.89,69.85 270 top
R18  90.8,69.85 270 top
R27  87.62,40.96 90 top
R28  88.57,38.1 180 top
REG1  11.42,85.09 0 top
REG2  21.58,85.09 0 top
S1  -92.72,12.7 270 top  (outside the outline)
SOC_1  74.92,93.98 180 top
T1  50.47,85.72 90 top
TFT1  72.38,20.32 0 top
U$2  -80.65,31.75 0 bottom  (outside the outline)

### Tracks (layer width: path | path; a pad name or v marks a point on that pad's centre or on a via)
10.4V  (via drill 0.6)
  Top 0.191: TFT1.8 63.63,22.36 v62.22,20.95
  Top 0.406: v54.6,78.74 54.6,86.61 C18.+
  Top 0.508: T1.2 51.57,87.14 52.32,87.89 C18.+ 52.32,91.38 C15.1
  Bottom 0.406: v62.22,20.95 62.22,24.13 57.14,29.21 57.14,40.64 49.52,48.26 49.52,72.55 54.6,77.63 v54.6,78.74
16V  (via drill 0.6)
  Top 0.191: TFT1.10 64.63,27.28 v63.97,27.94
  Top 0.406: R27.2 v87.62,43.18
  Top 0.508: D1.C 41.79,88.01 C29.+ 44.5,87.95 C13.1 46.98,86.68 v47.3,86.36 | R11.2 v47.3,86.36 | R10.1 v52.69,95.25 v52.7,95.25 | v47.3,86.36 48.74,86.36 T1.3
  Bottom 0.406: v63.97,27.94 83.81,27.94 87.62,31.75 v87.62,43.18 78.73,43.18 74.92,39.37 64.76,39.37 63.49,40.64 59.68,40.64 52.06,48.26 52.06,72.39 57.14,77.47 57.14,81.44 52.22,86.36 52.06,86.36 | v47.3,86.36 52.06,86.36 | v52.7,95.25 52.7,87 52.06,86.36
+3V3  (30 unrouted)
  Top 0.191: TFT1.43 81.13,26.43 81.35,26.43 81.63,26.43 TFT1.44 | C25.2 27.61,54.93 28.32,54.22 IC1.97 | IC1.84 35.22,57.14 | IC1.58 50.8,50.79 51.11,50.48 C47.2 | IC1.124 23.65,42.39 23.33,42.07 C48.2 | IC4.9 IC4.10 50.51,21.95 49.2,20.64 48.2,20.64 | R5.1 46.29,19.37 | IC1.34 46.43,41.19 47.62,40.01 C26.2
  Top 0.203: R9.2 28.88,37.15 29.2,36.83 31.27,36.83 31.62,37.19 IC1.4
  Top 0.254: IC4.1 46.61,19.05 | 46.29,19.37 46.61,19.05 | 48.2,20.64 46.61,19.05
  Top 0.406: 81.35,26.43 81.35,30.16 81.99,30.8 81.99,35.63 82.54,36.19 | 82.54,36.52 C27.2 82.54,39.05 85.08,41.59 85.08,52.7 84.45,53.34 69.84,53.34 67.3,55.88 67.3,59.69 61.82,65.17 | 82.54,36.52 82.54,36.51 | R8.2 82.54,36.19 | 82.54,36.19 82.54,36.52 | 61.82,65.17 41.03,65.17 35.22,59.36 35.22,57.14 | SOC_1.4 75.18,77.72 74.92,77.47 | 61.82,65.17 61.82,66.91 71.11,76.2 73.65,76.2 74.92,77.47 | C17.2 74.92,77.47
  Top 0.61: C6.2 11.1,81.59 REG1.2 | C19.2 23.17,84.14 23.89,83.41 REG2.3
+5V  (via drill 0.6)  (1 unrouted)
  Top 0.406: IC5.6 82.23,66.36 81.91,66.04
  Top 0.508: IC3.4 IC3.5 36.07,95.92 L2.1
  Top 0.61: 3.8,67.31 5.07,66.04 v11.42,66.04 v22.85,66.04 | v30.47,66.04 33.01,68.58 v61.59,68.58 | v13.96,80.01 13.73,80.24 REG1.3 13.73,84.05 11.74,86.04 C7.2 | L2.1 v33.47,95.71
  Top 0.813: v68.57,68.58 69.84,68.58 74.46,63.96 L1.1 80.78,63.96 81.91,65.09 81.91,66.04
  Top 1.016: R15.1 80.64,67.94 78.73,66.04 L1.1
  Bottom 0.813: v61.59,68.58 v68.57,68.58 | v22.85,66.04 v30.47,66.04 | v11.42,66.04 13.96,68.58 v13.96,80.01 13.96,88.9 20.77,95.71 v33.47,95.71
-7V  (via drill 0.6)
  Top 0.191: TFT1.9 64.13,21.59 v63.49,20.95
  Top 0.508: C11.1 R6.1 43.28,85.52 D4.C v45.08,83.82
  Bottom 0.406: v45.08,83.82 53.33,83.82 55.87,81.28 55.87,77.47 50.79,72.39 50.79,48.26 58.41,40.64 58.41,29.21 63.49,24.13 v63.49,20.95
BOOT0  (2 unrouted)
BOOT1  (1 unrouted)
D0  (via drill 0.6)
  Top 0.191: v77.46,52.07 76.67,51.28 68.1,51.28 66.35,53.02 66.35,59.37 61.43,64.29 41.43,64.29 36.42,59.29 IC1.81 | TFT1.34 76.63,42.35 77.46,43.18 v77.46,47.62
  Bottom 0.406: v77.46,52.07 v77.46,47.62
D1  (via drill 0.6)
  Top 0.191: v78.73,52.07 77.46,50.8 67.94,50.8 65.87,52.86 65.87,59.21 61.27,63.82 41.58,63.82 36.82,59.05 IC1.80 | TFT1.35 77.13,42.22 78.73,43.81 v78.73,47.62
  Bottom 0.406: v78.73,52.07 v78.73,47.62
D2  (via drill 0.6)
  Top 0.191: v80,52.07 78.26,50.32 67.78,50.32 65.4,52.7 65.4,59.05 61.11,63.34 41.74,63.34 37.22,58.82 IC1.79 | v80,47.62 80,44.45 77.63,42.08 TFT1.36
  Bottom 0.406: v80,52.07 v80,47.62
D3  (via drill 0.6)
  Top 0.191: v81.27,52.07 79.05,49.85 67.62,49.85 64.92,52.55 64.92,58.9 60.95,62.87 41.9,62.87 37.62,58.59 IC1.78 | v81.27,47.62 81.27,45.09 78.13,41.95 TFT1.37
  Bottom 0.406: v81.27,52.07 v81.27,47.62
D4  (via drill 0.6)
  Top 0.191: v82.54,52.07 79.84,49.37 67.46,49.37 64.44,52.39 64.44,58.74 60.79,62.39 42.06,62.39 38.02,58.35 IC1.77 | v82.54,47.62 82.54,45.72 78.63,41.81 TFT1.38
  Bottom 0.406: v82.54,52.07 v82.54,47.62
D5  (via drill 0.6)
  Top 0.191: v83.81,52.07 80.64,48.9 67.3,48.9 63.97,52.23 63.97,58.58 60.63,61.91 42.22,61.91 38.42,58.12 IC1.76 | v83.81,47.62 83.81,46.35 79.13,41.67 TFT1.39
  Bottom 0.406: v83.81,52.07 v83.81,47.62
D6  (via drill 0.6)
  Top 0.191: IC1.72 40.02,59.08 42.38,61.44 60.48,61.44 63.49,58.42 63.49,51.59 68.25,46.83 69.05,46.83 v69.84,47.62 | v69.84,43.18 69.84,42.55 72.63,39.76 TFT1.26
  Bottom 0.406: v69.84,47.62 v69.84,43.18
D7  (via drill 0.6)
  Top 0.191: IC1.71 40.42,58.84 42.54,60.96 60.32,60.96 63.02,58.26 63.02,51.44 68.1,46.35 69.84,46.35 v71.11,47.62 | v71.11,43.18 71.11,41.91 73.13,39.89 TFT1.27
  Bottom 0.406: v71.11,47.62 v71.11,43.18
D8  (via drill 0.6)
  Top 0.191: IC1.70 40.82,58.61 42.7,60.48 60.16,60.48 62.54,58.1 62.54,51.28 67.94,45.88 70.64,45.88 v72.38,47.62 | v72.38,43.18 72.38,41.27 73.63,40.02 TFT1.28
  Bottom 0.406: v72.38,47.62 v72.38,43.18
D9  (via drill 0.6)
  Top 0.191: IC1.69 41.22,58.38 42.85,60.01 60,60.01 62.06,57.94 62.06,51.12 67.78,45.4 71.43,45.4 v73.65,47.62 | v73.65,43.18 73.65,41.91 74.13,41.43 TFT1.29
  Bottom 0.406: v73.65,47.62 v73.65,43.18
D10  (via drill 0.6)
  Top 0.191: IC1.68 41.62,58.14 43.01,59.53 59.84,59.53 61.59,57.78 61.59,50.96 67.62,44.93 72.22,44.93 v74.92,47.62 | v74.92,43.18 74.92,41.91 74.63,41.62 TFT1.30
  Bottom 0.406: v74.92,47.62 v74.92,43.18
D11  (via drill 0.6)
  Top 0.191: IC1.67 42.02,57.91 43.17,59.05 59.68,59.05 61.11,57.63 61.11,50.8 67.46,44.45 73.02,44.45 v76.19,47.62 | TFT1.31 75.13,41.48 76.19,42.55 v76.19,43.18
  Bottom 0.406: v76.19,47.62 v76.19,43.18
D12  (via drill 0.6)
  Top 0.191: IC1.63 56.42,52.79 62.22,46.99 v63.49,46.99 | v64.76,41.27 64.76,40.64 68.63,36.77 TFT1.18
  Bottom 0.406: v63.49,46.99 v64.76,41.27
D13  (via drill 0.6)
  Top 0.191: IC1.62 56.19,52.39 62.86,45.72 v64.76,45.72 | TFT1.19 69.13,36.91 66.03,40.01 v66.03,41.27
  Bottom 0.406: v64.76,45.72 v66.03,41.27
D14  (via drill 0.6)
  Top 0.191: IC1.61 55.95,51.99 63.49,44.45 v66.03,44.45 | v67.3,41.27 67.3,40.64 69.63,38.31 TFT1.20
  Bottom 0.406: v66.03,44.45 v67.3,41.27
D15  (via drill 0.6)
  Top 0.191: IC1.60 55.72,51.59 64.13,43.18 v68.57,43.18 | v68.57,41.27 70.13,39.72 TFT1.21
  Bottom 0.406: v68.57,43.18 v68.57,41.27
D16
  Top 0.191: IC1.59 55.48,51.19 64.13,42.55 67.78,42.55 68.1,42.23 69.52,42.23 70.63,41.12 TFT1.22
D17  (via drill 0.6)
  Top 0.191: TFT1.23 71.13,32.72 v71.75,33.34 | IC1.35 47.3,41.59 49.52,39.37 51.43,39.37 52.22,39.85 60.48,39.85 62.54,37.78 v62.54,33.34
  Bottom 0.406: v71.75,33.34 v62.54,33.34
DCLK
  Top 0.191: IC1.45 52.83,45.59 55.71,42.7 61.43,42.7 67.3,36.83 67.3,33.97 66.63,33.3 TFT1.14
DTB
  Top 0.191: IC1.38 49.91,42.79 52.38,40.32 60.63,40.32 63.54,37.42 63.54,33.06 61.63,31.16 TFT1.4
GND  (via drill 0.6)  (24 unrouted)
  Top 0.191: TFT1.13 66.13,21.81 | 66.13,21.81 66.35,21.59 66.98,21.59 67.13,21.74 TFT1.15 TFT1.16 TFT1.17 68.13,22.03 68.57,21.59 71.43,21.59 71.63,21.79 TFT1.24 TFT1.25 72.13,21.84 72.38,21.59 75.24,21.59 75.63,21.98 TFT1.32 TFT1.33 76.13,21.97 76.51,21.59 82.22,21.59 82.63,22 TFT1.46 82.63,28.03 89.52,34.92 C28.2 | 65.91,21.59 66.13,21.81 | 61.13,36.65 53.33,35.56 | IC1.96 30.42,55.88 | 30.42,55.88 30.42,56.83 | 30.42,56.83 30.42,56.96 30.16,57.23 C24.1 | C25.1 26.98,56.83 27.93,55.88 30.42,55.88 | C26.1 C50.1 45.95,39.13 44.92,40.16 IC1.33 | IC1.94 31.22,56.72 31.11,56.83 30.42,56.83 | C23.1 44.76,56.83 43.22,55.29 IC1.65 | 46.98,50.01 46.6,50.39 IC1.57 | IC1.55 46.57,49.59 46.98,50.01 | C47.1 48.25,49.53 47.78,50.01 46.98,50.01 | IC1.109 25.9,48.39 25.55,48.74 C49.1 | IC1.2 30.82,40.35 31.03,40.56 | 31.03,40.56 31.11,40.64 | IC1.3 31.22,40.37 31.03,40.56 | IC1.17 36.82,40.16 36.5,40.48 | IC1.19 37.62,40.17 37.77,40.32 38.02,40.08 IC1.20 | IC1.125 26.74,41.99 26.03,41.27 C48.1 | 37.14,33.34 39.22,35.42 IC1.23 | 60.63,21.27 61.13,21.77 TFT1.3 61.13,26.81 60.48,27.46 60.48,34.29
  Top 0.254: IC4.6 49.86,19.07 50.16,19.37
  Top 0.305: v85.72,40.01 85.72,38.73 85.08,38.1 85.72,37.47 C10.1
  Top 0.406: C21.1 C20.1 37.14,33.34 | R17.2 C16.2 86.99,67.63 86.67,67.31 IC5.2 84.45,67.31 83.81,67.94 83.81,72.39 88.13,76.71 88.13,77.47 | R18.2 R17.2 | C31.- R17.2 | SOC_1.6 80.26,78.36 79.37,77.47 | 79.37,77.47 C17.1 | 79.37,77.47 80.64,76.2 v80,76.2 | 88.13,77.47 SOC_1.15 88.13,87.63 | SOC_1.3 72.64,86.61 73.65,87.63 | 88.13,87.63 SOC_1.14 | 73.65,87.63 88.13,87.63 | SOC_1.13 60.95,88.9 62.22,87.63 | 62.22,87.63 73.65,87.63 | SOC_1.12 62.73,87.12 62.22,87.63 | C11.2 R6.2 | C18.- 48.32,89.85 C13.2 C12.2 45.14,91.76 C29.- IC3.2 44.44,93.98 43.81,94.61 41.27,94.61 40.63,93.98 | 81.59,78.42 v81.27,78.74 | 87.18,78.42 88.13,77.47
  Top 0.508: C12.2 R7.2 C15.2 | C30.+ 51.36,80.47 D5.A 51.86,82.98 C14.2 | C29.- 44.06,91.06 43.17,90.17 40.63,90.17 39.36,88.9 39.36,86.36 | D3.C 38.55,85.55 39.36,86.36 | R6.2 40.63,85.09 39.36,86.36
  other vias: 89.53,40.01 61.59,34.92 68.57,63.5 71.11,60.96 73.65,58.42 91.43,67.31 68.57,92.71 80,87.63 82.54,92.71 27.93,60.96 38.09,66.04 30.47,63.5 35.55,63.5 44.44,39.05 34.28,48.26 39.36,48.26 39.36,44.45 34.28,44.45 36.82,45.72 36.82,46.99 58.41,54.61 43.81,57.78 38.73,33.66 40,33.66 73.65,68.58 77.46,68.58 76.19,67.31 41.58,89.85 39.36,87.63 71.11,87.63 29.2,15.24 33.01,15.24 45.71,11.43 44.44,12.7 85.08,72.39
  pour Top (isolate 0.191): 29.2,53.34 30.47,54.61 43.17,54.61 44.44,53.34 44.44,40.64 43.17,39.37 30.47,39.37 29.2,40.64
  pour Top (isolate 0.61): -54.62,100.33 97.78,100.33 97.78,0 -54.62,0
  cutout Bottom (isolate 0.61): -34.3,104.14 97.78,100.33 97.78,0 -35.57,0
HS  (via drill 0.6)
  Top 0.191: IC1.44 52.59,45.19 55.55,42.23 61.27,42.23 66.35,37.15 v66.35,35.56 | v80,35.56 79.63,35.19 TFT1.40
  Bottom 0.406: v66.35,35.56 v80,35.56
LDEN  (via drill 0.6)
  Top 0.191: TFT1.42 80.63,30.79 v80.95,31.11 | v67.62,31.11 67.94,31.43 67.94,36.83 61.59,43.18 55.87,43.18 51.74,47.31 46.35,47.31 46.23,47.19 IC1.49
  Bottom 0.406: v80.95,31.11 v67.62,31.11
LED+
  Top 0.191: TFT1.49 84.13,26.43 84.37,26.43 84.63,26.43 TFT1.50
  Top 0.406: 84.37,26.43 84.37,27.07 92.07,34.77 92.07,53.98 91.43,54.61 91.43,58.42 88.89,60.96 C31.+ | IC5.5 83.18,67.31 83.81,66.67 83.81,66.04 84.45,65.41 D6.C
  Top 1.016: C31.+ 84.85,63.88 D6.C
LED-  (via drill 0.6)
  Top 0.191: TFT1.47 83.13,26.43 83.34,26.43 83.63,26.43 TFT1.48
  Top 0.406: 83.34,26.43 83.34,27.15 91.27,35.08 91.27,53.5 90.16,54.61 v90.16,57.15 | R18.1 R17.1 C16.1 86.03,70.8 v85.08,69.85 85.08,68.29 IC5.3
  Bottom 0.406: v85.08,69.85 88.89,66.04 88.89,60.96 90.16,59.69 v90.16,57.15
LED_A  (via drill 0.6)
  Top 0.406: 3.8,69.85 5.07,68.58 25.39,68.58 31.42,74.61 62.54,74.61 v62.86,74.93 | v71.75,74.93 76.83,74.93 77.46,74.3 R12.1
  Bottom 0.406: v62.86,74.93 v71.75,74.93
LR  (via drill 0.6)
  Top 0.191: TFT1.12 65.63,33.42 64.76,34.29 64.76,37.47 60.95,41.27 55.24,41.27 54.6,41.91 v53.33,41.91 | IC1.36 48.17,41.99 49.52,40.64 v50.79,40.64
  Bottom 0.406: v50.79,40.64 v53.33,41.91
N$1  (1 unrouted)
N$2  (via drill 3)
  other vias: -59.7,3.81
N$3  (via drill 3)
  other vias: -59.7,36.83
N$4  (via drill 3)
  other vias: -101.61,39.37
N$5
  Top 0.191: IC1.24 39.62,36.57 42.85,33.34 R14.1
N$6
  Top 0.508: IC3.1 43,93.31 D1.A | C9.2 35.23,89.08 L2.2
  Top 0.61: D1.A 40.62,91.9 38.43,89.71 | 38.43,89.71 38.41,89.69 | L2.2 38.43,89.71
N$7
  Top 0.508: D2.C 39.22,79.69 D3.A 35.23,83.67 C9.1
N$8
  Top 0.508: D4.A 44.59,81.63 D2.A 46.73,79.69 C30.-
N$9
  Top 0.508: R10.2 R7.1 C12.1 45.74,93.66 IC3.3
N$10  (via drill 3.05)
  other vias: 0.45,3
N$11  (via drill 0.6)
  Top 0.406: IC5.1 86.03,66.36 86.35,66.04 v86.35,65.41
  Top 0.61: v86.35,60.18 D6.A
  Top 0.813: L1.2 82.23,57.96 D6.A
  Bottom 0.406: v86.35,60.18 v86.35,65.41
N$12
  Top 0.508: T1.1 50.79,84.78 50.16,84.14 C14.1 | C14.1 | D5.C 47.3,82.12 R11.1 47.62,83.19 C14.1
N$13
  Top 0.406: R13.2 R12.2 78.58,71.44 79.05,71.91 79.05,72.87 79.53,73.34 R15.2 81.43,73.34 | R16.1 83.34,75.25 81.43,73.34 | IC5.4 82.51,72.26 81.43,73.34
N$14  (via drill 3.05)
  other vias: 94.45,3
N$15
  Top 0.191: 33.33,28.32 Q4.2 | C21.2 33.33,32.7 34.92,34.29 36.82,34.29 38.82,36.29 IC1.22
  Top 0.406: C21.2 33.33,28.32
N$16
  Top 0.406: C20.2 R14.2 40.95,30.22 Q4.1
N$18  (via drill 3.05)
  other vias: 94.45,97
N$24
  Top 0.191: IC1.128 28.32,40.4 27.93,40.01 R9.1
N$25  (via drill 3.05)
  other vias: 0.45,97
N$28  (via drill 0.6)
  Top 0.191: TFT1.7 63.13,28.85 64.13,29.84 v64.13,32.38 | v83.81,32.38 R8.1
  Top 0.406: C10.2 R8.1
  Bottom 0.406: v64.13,32.38 v83.81,32.38
NRST  (4 unrouted)
OSC_IN  (2 unrouted)
OSC_OUT  (2 unrouted)
PA15  (1 unrouted)
PB4  (1 unrouted)
PWM  (via drill 0.6)
  Top 0.191: IC1.51 47.25,47.99 47.46,47.78 51.59,47.78 52.06,48.26 52.38,48.26
  Top 0.406: v54.6,48.26 52.38,48.26 | R13.1 70.79,73.34 v63.49,66.04
  Bottom 0.406: v63.49,66.04 54.6,57.15 v54.6,48.26
S$1  (via drill 3)
  other vias: -101.61,3.81
SD_CLK  (via drill 0.6)
  Top 0.406: v17.77,62.23 22.85,62.23 32.38,71.75 64.13,71.75 70.48,78.11 72.38,78.11 73.65,79.38 73.65,82.23 74.29,82.87 77.14,82.87 77.72,82.3 SOC_1.5
  Bottom 0.406: v12.69,62.23 v17.77,62.23
SD_CS
  Top 0.406: 25.39,67.31 31.74,73.66 63.49,73.66 67.56,77.72 SOC_1.1
SD_DIN
  Top 0.406: 24.12,64.77 32.06,72.71 63.81,72.71 70.1,78.99 SOC_1.2
SD_DO  (via drill 0.6)
  Top 0.406: v20.31,59.69 21.58,59.69 32.69,70.8 64.44,70.8 70.79,77.15 72.7,77.15 74.29,78.74 74.29,81.92 74.6,82.23 76.19,82.23 76.51,81.92 76.51,79.69 77.14,79.06 78.1,79.06 78.73,79.69 78.73,81.6 79.37,82.23 82.22,82.23 82.8,81.66 SOC_1.7
  Bottom 0.406: v15.23,59.69 v20.31,59.69
T_IRQ
  Top 0.254: IC4.11 49.86,22.25 48.88,21.27 R5.2
TFT_0
  Top 0.203: IC1.7 32.82,36.64 31.74,35.56 25.39,35.56 20.79,40.16 0.21,40.16 IC2.114
TFT_1  (via drill 0.6)
  Top 0.203: IC1.8 33.22,36.41 31.9,35.08 25.23,35.08 21.11,39.21 v19.04,39.21 | IC2.115 -0.02,40.64 18.57,40.64 v19.04,41.12
  Bottom 0.203: v19.04,39.21 v19.04,41.12
TFT_2  (via drill 0.6)
  Top 0.203: IC1.9 33.62,36.17 32.06,34.61 25.07,34.61 21.58,38.1 18.41,38.1 17.77,38.73 v17.77,39.21 | v17.77,41.59 17.3,41.12 -0.25,41.12 IC2.116
  Bottom 0.203: v17.77,39.21 v17.77,41.59
TFT_3  (via drill 0.6)
  Top 0.203: IC1.10 34.02,35.94 32.22,34.13 24.92,34.13 21.42,37.62 18.09,37.62 v16.5,39.21 | v16.5,42.07 16.03,41.59 -0.48,41.59 IC2.117
  Bottom 0.203: v16.5,39.21 v16.5,42.07
TFT_4  (via drill 0.6)
  Top 0.203: IC1.11 34.42,35.7 32.38,33.66 24.76,33.66 21.26,37.15 17.3,37.15 v15.23,39.21 | v15.23,42.55 14.76,42.07 -0.72,42.07 IC2.118
  Bottom 0.203: v15.23,39.21 v15.23,42.55
TFT_5
  Top 0.203: IC1.116 27.17,45.59 25.23,43.66 14.91,43.66 13.96,42.7 -0.79,42.7 IC2.119
TFT_6
  Top 0.203: IC1.115 26.93,45.99 25.07,44.13 14.76,44.13 13.8,43.18 -2.43,43.18 IC2.122
TFT_7
  Top 0.203: IC1.114 26.7,46.39 24.92,44.61 14.6,44.61 13.64,43.66 -2.66,43.66 IC2.123
TFT_8  (via drill 0.6)
  Top 0.203: IC1.113 26.46,46.79 24.76,45.09 13.17,45.09 v12.69,44.61 | v12.69,39.21 12.69,38.58 9.2,35.08 9.2,27.3 4.75,22.86 -8.28,22.86 IC2.77
  Bottom 0.203: v12.69,44.61 v12.69,39.21
TFT_9  (via drill 0.6)
  Top 0.203: IC1.112 26.23,47.19 24.6,45.56 12.22,45.56 11.42,44.77 v11.42,44.61 | v11.42,39.21 11.42,37.94 8.72,35.24 8.72,27.46 4.6,23.34 -8.05,23.34 IC2.78
  Bottom 0.203: v11.42,44.61 v11.42,39.21
TFT_10  (via drill 0.6)
  Top 0.203: IC1.111 25.99,47.59 24.44,46.04 11.1,46.04 10.15,45.09 v10.15,44.61 | v10.15,39.21 10.15,37.31 8.25,35.4 8.25,27.62 4.44,23.81 -7.82,23.81 IC2.79
  Bottom 0.203: v10.15,44.61 v10.15,39.21
TFT_11  (via drill 0.6)
  Top 0.203: IC1.107 26.21,49.19 24.6,50.8 21.58,50.8 18.25,47.47 13.8,47.47 12.85,46.51 9.68,46.51 8.88,45.72 v8.88,44.45 | v8.88,39.21 8.88,36.67 7.77,35.56 7.77,27.78 4.28,24.29 -7.59,24.29 IC2.80
  Bottom 0.203: v8.88,44.45 v8.88,39.21
TFT_12  (via drill 0.6)
  Top 0.203: IC1.106 26.44,49.59 24.76,51.28 21.42,51.28 18.09,47.94 13.64,47.94 12.69,46.99 8.88,46.99 7.61,45.72 v7.61,44.61 | v7.61,39.21 7.61,36.04 7.29,35.72 7.29,27.94 4.12,24.77 -7.36,24.77 IC2.81
  Bottom 0.203: v7.61,44.61 v7.61,39.21
TFT_13  (via drill 0.6)
  Top 0.203: IC1.105 26.68,49.99 24.92,51.75 21.26,51.75 17.93,48.42 13.49,48.42 12.53,47.47 8.09,47.47 6.34,45.72 v6.34,44.61 | v6.34,39.21 6.34,36.2 6.82,35.72 6.82,28.1 3.96,25.24 -7.13,25.24 IC2.82
  Bottom 0.203: v6.34,44.61 v6.34,39.21
TFT_14  (via drill 0.6)
  Top 0.203: IC1.104 26.91,50.39 25.07,52.23 21.11,52.23 17.77,48.9 13.33,48.9 12.37,47.94 7.29,47.94 5.07,45.72 v5.07,44.61 | v5.07,39.37 5.07,36.83 6.34,35.56 6.34,28.26 3.8,25.72 -5.49,25.72 IC2.85
  Bottom 0.203: v5.07,44.61 v5.07,39.37
TFT_15  (via drill 0.6)
  Top 0.203: IC1.103 27.15,50.79 25.23,52.7 20.95,52.7 17.61,49.37 13.17,49.37 12.22,48.42 6.5,48.42 3.8,45.72 v3.8,44.61 | v3.8,39.37 3.8,37.47 5.87,35.4 5.87,28.42 3.64,26.19 -5.25,26.19 IC2.86
  Bottom 0.203: v3.8,44.61 v3.8,39.37
TFT_CS  (2 unrouted)
UD  (via drill 0.6)
  Top 0.191: TFT1.11 65.13,33.28 64.13,34.29 64.13,37.47 60.79,40.8 53.17,40.8 v52.06,41.91 | IC1.37 49.04,42.39 v49.52,41.91
  Bottom 0.406: v49.52,41.91 v52.06,41.91
VBAT  (1 unrouted)
VCC/2  (via drill 0.6)
  Top 0.191: C24.2 32.06,57.15 31.62,56.71 IC1.93 31.62,53.62 32.54,52.7 v33.01,52.7 | IC1.1 30.42,41.17 | C50.2 43.25,37.15 42.82,37.58 IC1.32 42.82,40.99 v42.06,41.91 | v31.74,48.26 31.47,47.99 IC1.110 25.76,47.99 25.07,47.31 23.17,47.31 22.69,47.78 C49.2 | IC1.102 31.19,51.19 v31.74,50.64 | IC1.73 39.62,52.76 v39.68,52.7 | C23.2 45.71,54.13 44.92,53.34 IC1.64 43.58,53.19 43.01,52.63 43.01,52.07 42.38,51.44 v42.06,51.44 | IC1.82 36.02,53.02 v36.03,52.7 | IC1.56 42.36,49.99 v42.06,49.53 | IC1.40 42.44,43.59 v42.06,43.97 | IC1.126 30,41.59 30.42,41.17 | IC1.119 30.41,44.39 30.87,44.85 v31.74,44.85 | IC1.46 43.12,45.99 43.01,45.88 v42.06,45.88 | v36.9,41.91 36.9,40.88 37.22,40.56 IC1.18 | v38.57,41.91 38.57,40.8 38.42,40.65 IC1.21 | v40.31,41.91 40.31,40.96 40.02,40.66 IC1.25 | v35.15,41.91 35.15,41.2 35.62,40.73 IC1.14 | v33.49,41.12 32.42,40.05 IC1.6 | 30.42,41.17 31,41.17 v32.38,42.55
  Top 0.61: REG2.2 21.26,81.59 C22.2 21.26,77.79 v22.85,76.2
  Bottom 0.406: 33.49,41.91 33.01,41.91
  Bottom 0.813: v31.74,44.85 v31.74,48.26 v31.74,50.64 | v22.85,76.2 33.01,66.04 v33.01,52.7
  Bottom 1.016: v33.01,52.7 v36.03,52.7 v39.68,52.7 40.79,52.7 v42.06,51.44 v42.06,49.53 v42.06,45.88 v42.06,43.97 v42.06,41.91 v40.31,41.91 v38.57,41.91 v36.9,41.91 v35.15,41.91 33.49,41.91 v33.49,41.12 | 33.01,41.91 v32.38,42.55 31.74,43.18 v31.74,44.85
VCOM  (via drill 0.6)
  Top 0.191: TFT1.5 62.13,29.12 v62.86,29.84 | TFT1.45 82.13,29.43 v82.54,29.84 83.73,29.84 87.62,33.74 C28.1
  Top 0.508: R27.1 R28.2 C28.1
  Bottom 0.406: v62.86,29.84 v82.54,29.84
VDD  (10 unrouted)
VS  (via drill 0.6)
  Top 0.191: IC1.43 52.36,44.79 55.4,41.75 61.11,41.75 65.4,37.47 65.4,34.92 v66.03,34.29 | TFT1.41 80.13,33.78 v80.64,34.29
  Bottom 0.406: v66.03,34.29 v80.64,34.29
VSS  (10 unrouted)
X+  (via drill 0.6)
  Top 0.254: FC-4P_2.10 12.92,15.47 13.33,15.88 22.22,15.88 22.62,15.47 FC-4P_1.7 22.62,12.63 v22.38,12.38 | IC4.2 47.26,15.52 46.98,15.24 40.79,15.24 40.16,15.88 37.77,15.88 37.32,15.42 FC-4P_3.9 37.32,12.88 v36.82,12.38
  Bottom 0.406: v36.82,12.38 v22.38,12.38
X-  (via drill 0.6)
  Top 0.254: FC-4P_2.8 10.92,16.17 11.9,17.14 23.65,17.14 24.62,16.17 FC-4P_1.9 24.62,10.77 v24.92,10.48 | FC-4P_3.7 35.32,11.52 | 35.32,11.52 v34.28,10.48 | IC4.4 48.56,9.68 47.3,8.41 38.43,8.41 35.32,11.52
  Bottom 0.406: v24.92,10.48 v34.28,10.48
Y+  (via drill 0.6)
  Top 0.254: FC-4P_2.9 11.92,15.74 12.69,16.51 22.85,16.51 23.62,15.74 FC-4P_1.8 23.62,11.45 v23.65,11.43 | IC4.3 47.91,9.82 46.98,8.89 39.36,8.89 38.09,10.16 v38.09,11.43 38.32,11.66 FC-4P_3.10
  Bottom 0.406: v23.65,11.43 v38.09,11.43
Y-
  Top 0.254: FC-4P_2.7 9.92,16.28 11.42,17.78 24.12,17.78 25.62,16.28 | 25.62,16.28 FC-4P_1.10 25.62,11.43 28.16,8.89 36.82,8.89 37.77,7.94 47.62,7.94 49.21,9.53 IC4.5 | FC-4P_3.8 36.32,17.01 35.55,17.78 27.12,17.78 25.62,16.28

### Text on the board
tPlace: TFT Driver V1.0 | PWM | LED_A | On | SDA | SCL | MOSI | MISO | TX | SCK | RX | NSS | NSS | RX | SCK | TX | MISO | MOSI | MISO | MOSI | SCL | SCK | SDA | NSS
bPlace: 0V | 3V3 | 5V